# EAGLE board combined (EAGLE 9.6.2), part 1 of 2
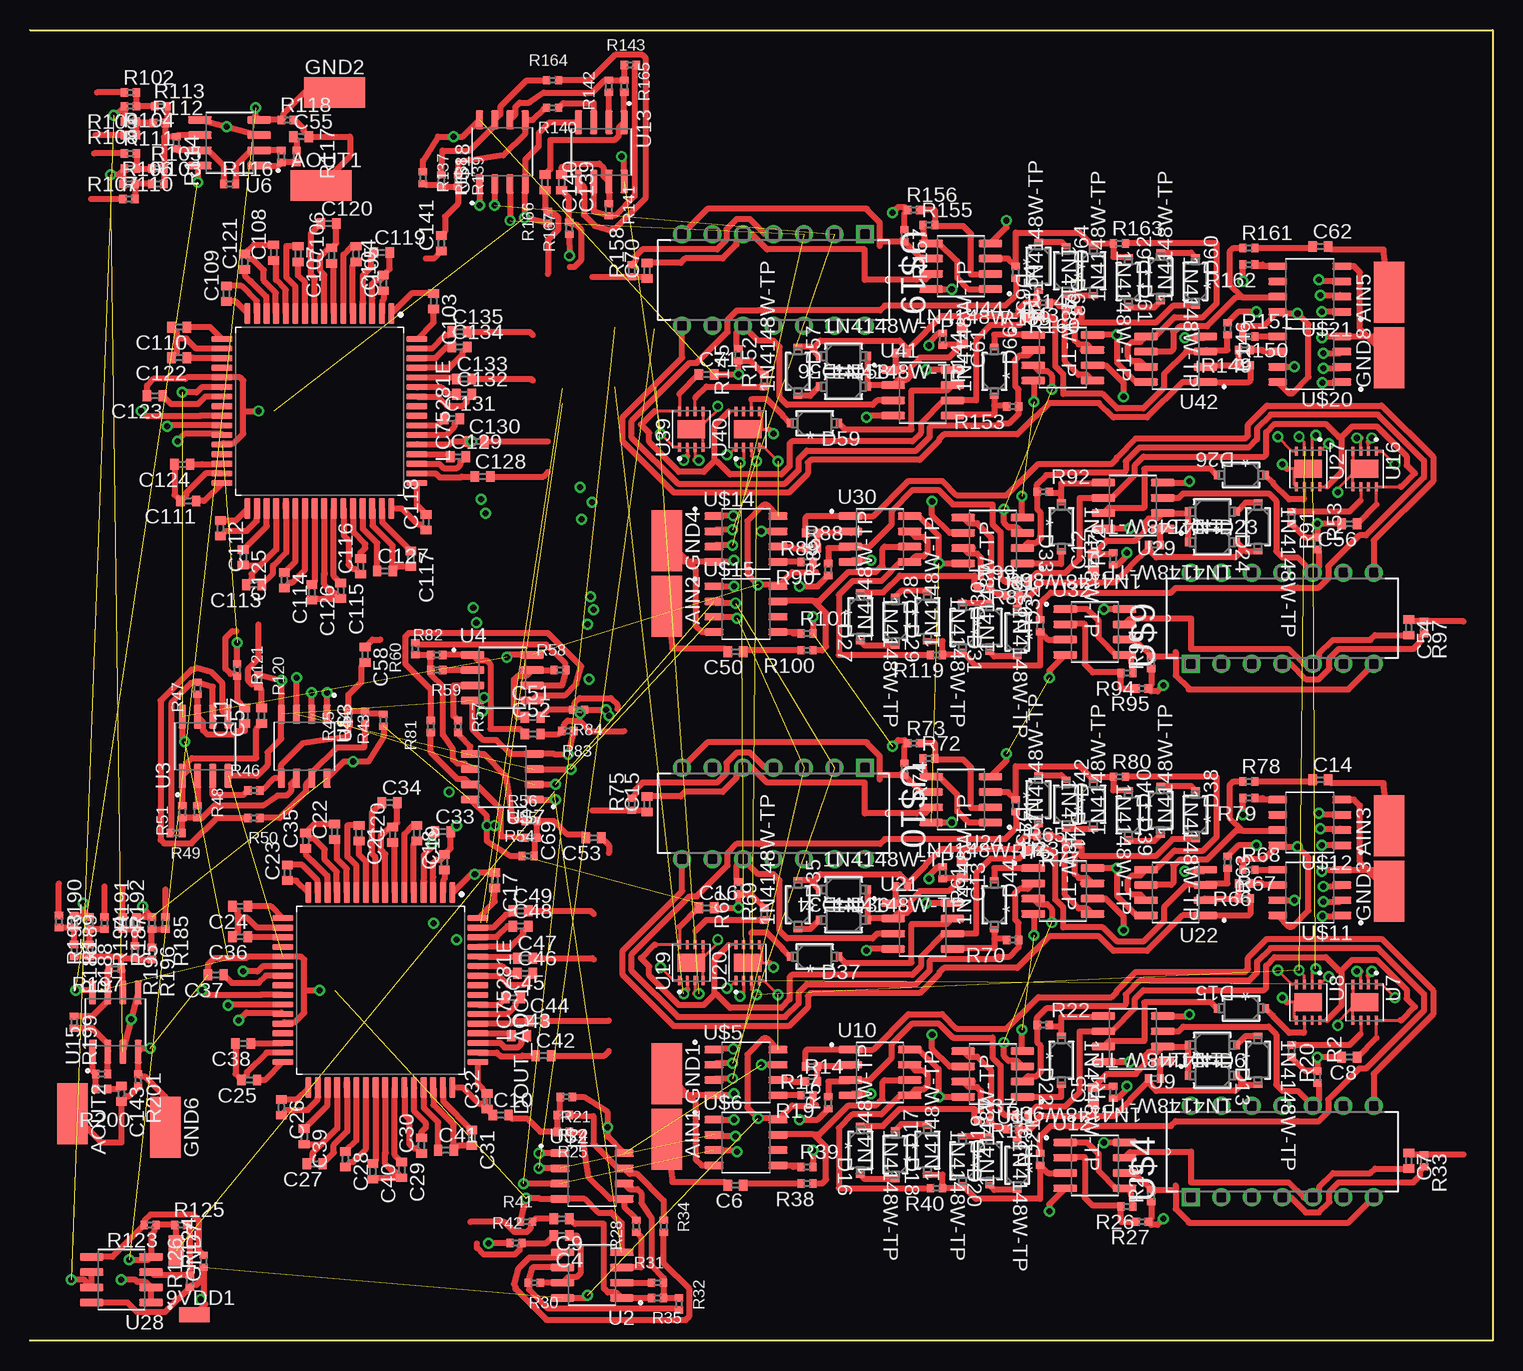
[diagram p5: board, top side]
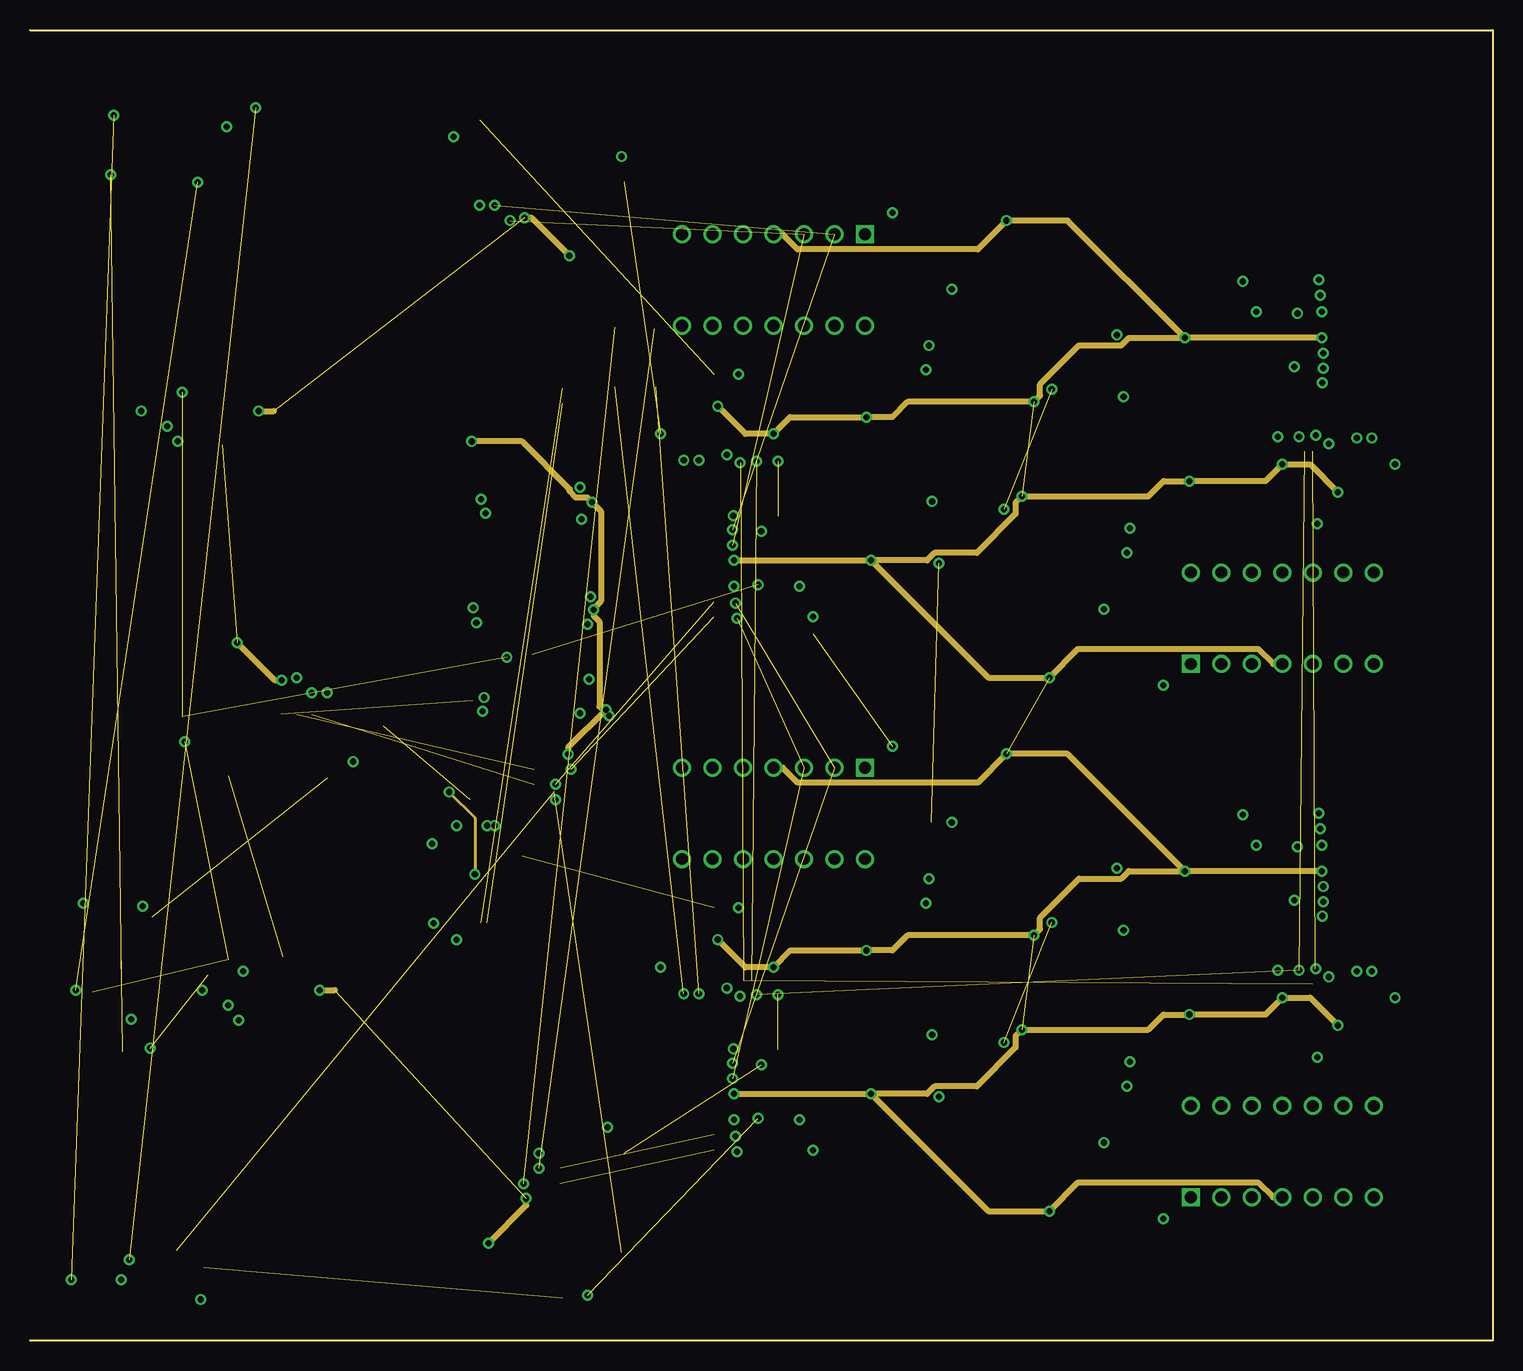
[diagram p6: board, inner layer Route2]
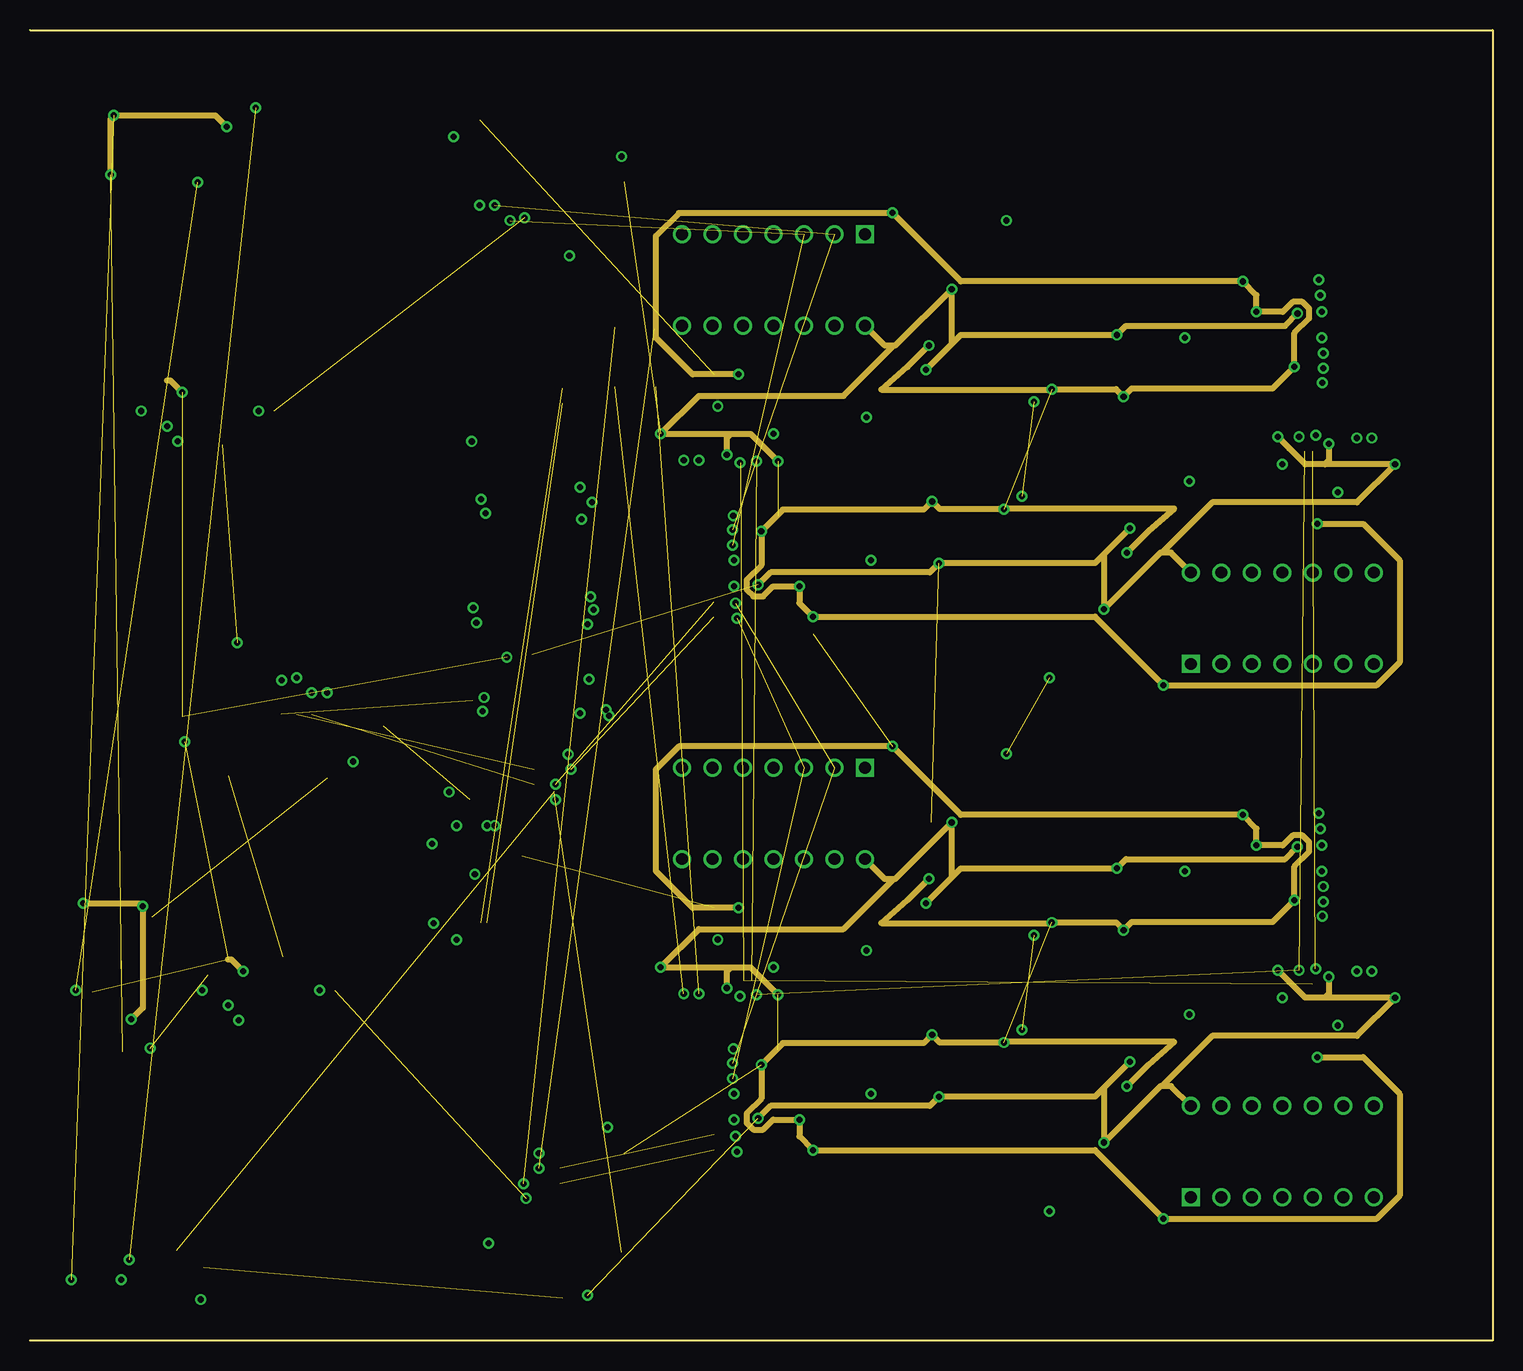
[diagram p7: board, inner layer Route15]
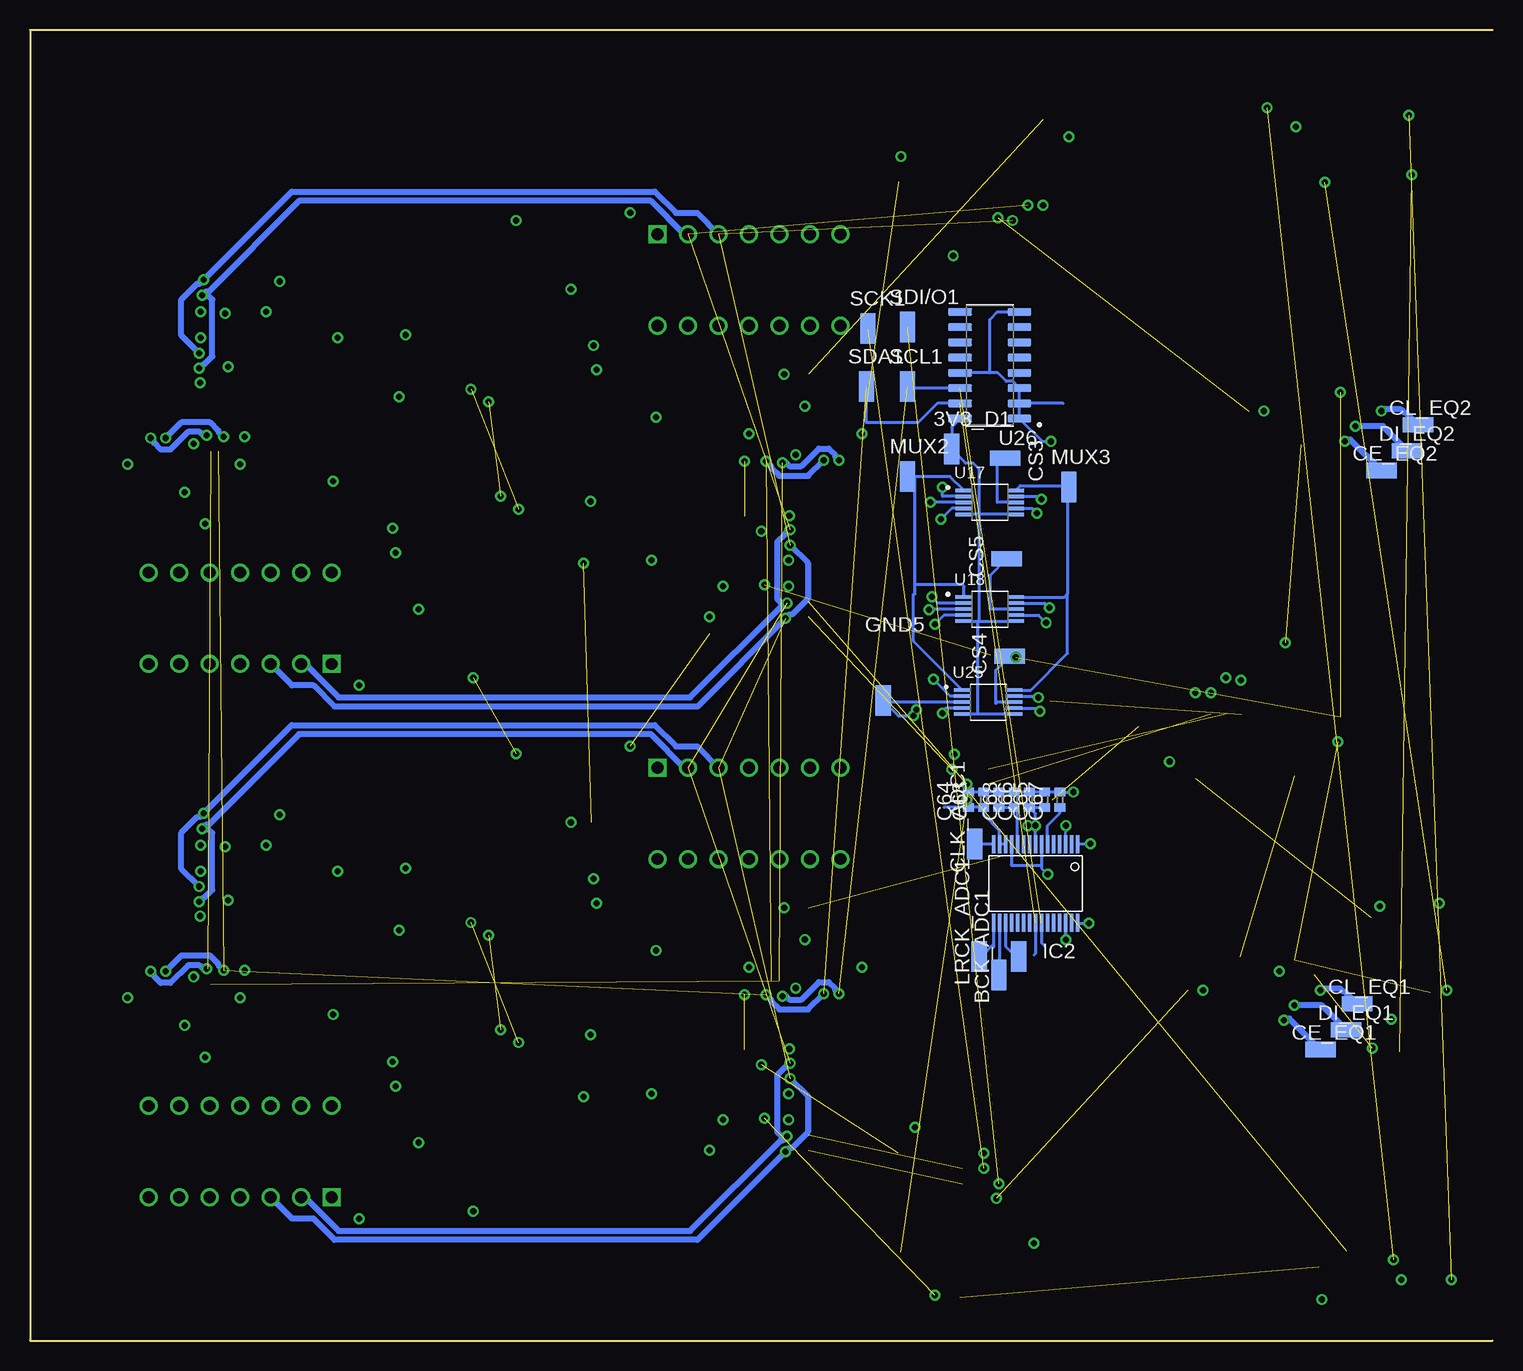
[diagram p8: board, bottom side, seen from below]

Size 121.92 x 109.22 mm. Coordinates in mm from the lower left corner, seen from the top.
Outline: 0,109.22 121.92,109.22 121.92,0 0,0
Copper layers (1+2*15+16): Top 0.035mm / dielectric 0.2mm / Route2 0.035mm / dielectric 0.15mm / Route15 0.035mm / dielectric 0.2mm / Bottom 0.035mm
Design rules "default *": minimum track width 6mil, minimum drill 0.35mm, track to track 6mil, track to pad 6mil, pad to pad 6mil, via to via 6mil, smd to smd 6mil, copper to edge 40mil, drill to drill 6mil, minimum pad ring 10mil, minimum via ring 8mil, stop-mask expansion 4mil, vias tented up to drill 0mil, thermal gap 10mil
Net classes: 4 ANALOG: width 0.508 mm, drill 0.508 mm, clearance 0.254 mm

## Footprints (pad centres in the part's own frame; a part is rotated, then mirrored left to right if it is on the bottom)
SMD1,27-2,54 = smd 1.27 x 2.54: 1 0,0
SMD2,54-5,08 = smd 2.54 x 5.08: 1 0,0
C0402 = smd 0.7 x 0.9: 1 -0.65,0; 2 0.65,0
SOD123 = smd 0.508 x 0.711: A 2.032,0; C -2.032,0
TSSOP-30 = smd 0.3 x 1.5: 1 -3.5,-3.27; 2 -3,-3.27; 3 -2.5,-3.27; 4 -2,-3.27; 5 -1.5,-3.27; 6 -1,-3.27; 7 -0.5,-3.27; 8 0,-3.27; 9 0.5,-3.27; 10 1,-3.27; 11 1.5,-3.27; 12 2,-3.27; 13 2.5,-3.27; 14 3,-3.27; 15 3.5,-3.27; 16 3.5,3.27; 17 3,3.27; 18 2.5,3.27; 19 2,3.27; 20 1.5,3.27; 21 1,3.27; 22 0.5,3.27; 23 0,3.27; 24 -0.5,3.27; 25 -1,3.27; 26 -1.5,3.27; 27 -2,3.27; 28 -2.5,3.27; 29 -3,3.27; 30 -3.5,3.27
R0402 = smd 0.6 x 0.7: 1 -0.5,0; 2 0.5,0
SOIC127P599X175-8N = smd 1.97 x 0.6: 1 -2.47,1.905; 2 -2.47,0.635; 3 -2.47,-0.635; 4 -2.47,-1.905; 5 2.47,-1.905; 6 2.47,-0.635; 7 2.47,0.635; 8 2.47,1.905
SON65P300X300X80-9N = smd 0.76 x 0.32: 1 -1.485,0.975; 2 -1.485,0.325; 3 -1.485,-0.325; 4 -1.485,-0.975; 5 1.485,-0.975; 6 1.485,-0.325; 7 1.485,0.325; 8 1.485,0.975 | smd 1.5 x 2.3: 9 0,0
SOP50P490X110-10N = smd 1.47 x 0.28: 1 -2.15,1; 2 -2.15,0.5; 3 -2.15,0; 4 -2.15,-0.5; 5 -2.15,-1; 6 2.15,-1; 7 2.15,-0.5; 8 2.15,0; 9 2.15,0.5; 10 2.15,1
SOIC127P600X175-16N = smd 1.97 x 0.6: 1 -2.475,4.445; 2 -2.475,3.175; 3 -2.475,1.905; 4 -2.475,0.635; 5 -2.475,-0.635; 6 -2.475,-1.905; 7 -2.475,-3.175; 8 -2.475,-4.445; 9 2.475,-4.445; 10 2.475,-3.175; 11 2.475,-1.905; 12 2.475,-0.635; 13 2.475,0.635; 14 2.475,1.905; 15 2.475,3.175; 16 2.475,4.445
SOIC127P599X175-8N' = smd 1.58 x 0.6: 1 -2.67,1.905; 2 -2.67,0.635; 3 -2.67,-0.635; 4 -2.67,-1.905; 5 2.67,-1.905; 6 2.67,-0.635; 7 2.67,0.635; 8 2.67,1.905
DIP254P762X432-14 = drill 0.991 square: 1 -7.62,15.24 | drill 0.991: 2 -7.62,12.7; 3 -7.62,10.16; 4 -7.62,7.62; 5 -7.62,5.08; 6 -7.62,2.54; 7 -7.62,0; 8 0,0; 9 0,2.54; 10 0,5.08; 11 0,7.62; 12 0,10.16; 13 0,12.7; 14 0,15.24
QFP80P1720X1720X270-64N = smd 1.758 x 0.522: 1 -8.127,6; 2 -8.127,5.2; 3 -8.127,4.4; 4 -8.127,3.6; 5 -8.127,2.8; 6 -8.127,2; 7 -8.127,1.2; 8 -8.127,0.4; 9 -8.127,-0.4; 10 -8.127,-1.2; 11 -8.127,-2; 12 -8.127,-2.8; 13 -8.127,-3.6; 14 -8.127,-4.4; 15 -8.127,-5.2; 16 -8.127,-6; 33 8.127,-6; 34 8.127,-5.2; 35 8.127,-4.4; 36 8.127,-3.6; 37 8.127,-2.8; 38 8.127,-2; 39 8.127,-1.2; 40 8.127,-0.4; 41 8.127,0.4; 42 8.127,1.2; 43 8.127,2; 44 8.127,2.8; 45 8.127,3.6; 46 8.127,4.4; 47 8.127,5.2; 48 8.127,6 | smd 0.522 x 1.758: 17 -6,-8.127; 18 -5.2,-8.127; 19 -4.4,-8.127; 20 -3.6,-8.127; 21 -2.8,-8.127; 22 -2,-8.127; 23 -1.2,-8.127; 24 -0.4,-8.127; 25 0.4,-8.127; 26 1.2,-8.127; 27 2,-8.127; 28 2.8,-8.127; 29 3.6,-8.127; 30 4.4,-8.127; 31 5.2,-8.127; 32 6,-8.127; 49 6,8.127; 50 5.2,8.127; 51 4.4,8.127; 52 3.6,8.127; 53 2.8,8.127; 54 2,8.127; 55 1.2,8.127; 56 0.4,8.127; 57 -0.4,8.127; 58 -1.2,8.127; 59 -2,8.127; 60 -2.8,8.127; 61 -3.6,8.127; 62 -4.4,8.127; 63 -5.2,8.127; 64 -6,8.127

## Placement (x,y rotation side)
3V3_D1  [SMD1,27-2,54]  45.09,74.3 0 bottom
9VDD1  [SMD1,27-2,54]  13.72,2.16 270 top
AIN1  [SMD2,54-5,08]  53.09,16.76 180 top
AIN2  [SMD2,54-5,08]  53.09,61.21 180 top
AIN3  [SMD2,54-5,08]  113.28,42.93 0 top
AIN5  [SMD2,54-5,08]  113.28,87.38 0 top
AOUT1  [SMD2,54-5,08]  24.26,96.27 270 top
AOUT2  [SMD2,54-5,08]  3.56,18.92 180 top
BCK_ADC1  [SMD1,27-2,54]  41.15,30.48 0 bottom
C4  0.1u  [C0402]  44.32,8.76 180 top
C5  680p  [C0402]  88.65,20.45 90 top
C6  0.1  [C0402]  58.8,12.95 180 top
C7  1.5u  [C0402]  114.94,14.99 270 top
C8  1.5u  [C0402]  109.98,23.62 180 top
C9  0.1u  [C0402]  44.32,10.16 180 top
C10  0.1u  [C0402]  39.24,18.8 0 top
C11  0.1u  [C0402]  17.91,52.07 90 top
C12  680p  [C0402]  88.65,64.9 90 top
C13  680p  [C0402]  77.72,39.24 270 top
C14  0.1  [C0402]  107.57,46.74 0 top
C15  1.5u  [C0402]  51.44,44.7 90 top
C16  1.5u  [C0402]  56.39,36.07 0 top
C17  0.047uF  [C0402]  38.73,38.35 270 top
C18  0.047uF  [C0402]  34.54,39.88 90 top
C19  0.047uF  [C0402]  32.26,42.29 270 top
C20  0.047uF  [C0402]  30.23,42.16 90 top
C21  0.047uF  [C0402]  27.43,42.29 270 top
C22  0.047uF  [C0402]  25.4,42.42 90 top
C23  0.047uF  [C0402]  21.46,38.99 90 top
C24  0.047uF  [C0402]  17.53,36.2 180 top
C25  0.047uF  [C0402]  18.29,21.72 180 top
C26  0.047uF  [C0402]  20.95,19.43 270 top
C27  0.047uF  [C0402]  23.75,14.73 180 top
C28  0.047uF  [C0402]  26.29,15.11 270 top
C29  0.047uF  [C0402]  30.99,14.22 270 top
C30  0.047uF  [C0402]  32.64,16.26 90 top
C31  0.047uF  [C0402]  36.83,16.89 270 top
C32  0.047uF  [C0402]  38.1,19.94 90 top
C33  10uF  [C0402]  34.42,42.42 0 top
C34  10uF  [C0402]  29.97,44.83 0 top
C35  10uF  [C0402]  22.99,41.66 90 top
C36  10uF  [C0402]  17.53,33.66 180 top
C37  10uF  [C0402]  15.49,30.48 180 top
C38  10uF  [C0402]  17.78,24.77 180 top
C39  10uF  [C0402]  22.86,17.02 270 top
C40  10uF  [C0402]  28.57,14.1 270 top
C41  10uF  [C0402]  34.67,15.88 0 top
C42  10uF  [C0402]  42.8,23.75 0 top
C43  10uF  [C0402]  40.77,25.4 0 top
C44  10uF  [C0402]  42.29,26.67 0 top
C45  10uF  [C0402]  40.26,28.57 0 top
C46  10uF  [C0402]  41.27,30.61 0 top
C47  10uF  [C0402]  41.27,31.88 0 top
C48  10uF  [C0402]  40.89,34.54 0 top
C49  10uF  [C0402]  40.89,35.81 0 top
C50  0.1  [C0402]  58.8,57.4 180 top
C51  0.1u  [C0402]  41.91,51.94 0 top
C52  0.1u  [C0402]  41.91,50.55 0 top
C53  0.1u  [C0402]  46.99,41.91 180 top
C54  1.5u  [C0402]  114.94,59.44 270 top
C55  0.1u  [C0402]  22.61,100.33 0 top
C56  1.5u  [C0402]  109.98,68.07 180 top
C57  0.1u  [C0402]  19.3,52.07 90 top
C58  0.1u  [C0402]  27.94,57.15 270 top
C61  680p  [C0402]  77.72,83.69 270 top
C62  0.1  [C0402]  107.57,91.19 0 top
C63  0.1μF  [C0402]  42.42,45.09 90 bottom
C64  10μF  [C0402]  43.69,45.09 90 bottom
C65  0.1μF  [C0402]  37.34,45.09 90 bottom
C66  10μF  [C0402]  38.61,45.09 90 bottom
C67  1μF  [C0402]  36.07,45.09 90 bottom
C68  0.1μF  [C0402]  39.88,45.09 90 bottom
C69  1μF  [C0402]  41.15,45.09 90 bottom
C70  1.5u  [C0402]  51.44,89.15 90 top
C71  1.5u  [C0402]  56.39,80.52 0 top
C103  0.047uF  [C0402]  33.66,86.61 270 top
C104  0.047uF  [C0402]  29.46,88.14 90 top
C105  0.047uF  [C0402]  27.18,90.55 270 top
C106  0.047uF  [C0402]  25.15,90.42 90 top
C107  0.047uF  [C0402]  22.35,90.55 270 top
C108  0.047uF  [C0402]  20.32,90.68 90 top
C109  0.047uF  [C0402]  16.38,87.25 90 top
C110  0.047uF  [C0402]  12.45,84.45 180 top
C111  0.047uF  [C0402]  13.21,69.98 180 top
C112  0.047uF  [C0402]  15.88,67.69 270 top
C113  0.047uF  [C0402]  18.67,62.99 180 top
C114  0.047uF  [C0402]  21.21,63.37 270 top
C115  0.047uF  [C0402]  25.91,62.48 270 top
C116  0.047uF  [C0402]  27.56,64.52 90 top
C117  0.047uF  [C0402]  31.75,65.15 270 top
C118  0.047uF  [C0402]  33.02,68.2 90 top
C119  10uF  [C0402]  29.34,90.68 0 top
C120  10uF  [C0402]  24.89,93.09 0 top
C121  10uF  [C0402]  17.91,89.92 90 top
C122  10uF  [C0402]  12.45,81.92 180 top
C123  10uF  [C0402]  10.41,78.74 180 top
C124  10uF  [C0402]  12.7,73.03 180 top
C125  10uF  [C0402]  17.78,65.28 270 top
C126  10uF  [C0402]  23.5,62.36 270 top
C127  10uF  [C0402]  29.59,64.14 0 top
C128  10uF  [C0402]  37.72,72.01 0 top
C129  10uF  [C0402]  35.69,73.66 0 top
C130  10uF  [C0402]  37.21,74.93 0 top
C131  10uF  [C0402]  35.18,76.83 0 top
C132  10uF  [C0402]  36.2,78.87 0 top
C133  10uF  [C0402]  36.2,80.14 0 top
C134  10uF  [C0402]  35.81,82.8 0 top
C135  10uF  [C0402]  35.81,84.07 0 top
C139  0.1u  [C0402]  44.32,96.52 270 top
C140  0.1u  [C0402]  42.93,96.52 270 top
C141  0.1u  [C0402]  34.29,91.44 90 top
C143  0.1u  [C0402]  7.62,20.57 270 top
CE_EQ1  [SMD1,27-2,54]  14.35,24.26 270 bottom
CE_EQ2  [SMD1,27-2,54]  9.27,72.52 270 bottom
CL_EQ1  [SMD1,27-2,54]  11.3,28.07 270 bottom
CL_EQ2  [SMD1,27-2,54]  6.22,76.33 270 bottom
CLK_ADC1  [SMD1,27-2,54]  43.18,41.4 0 bottom
CS3  [SMD1,27-2,54]  40.64,73.53 270 bottom
CS4  [SMD1,27-2,54]  40.26,57.02 90 bottom
CS5  [SMD1,27-2,54]  40.51,65.15 90 bottom
D6  1N4148W-TP  [SOD123]  98.55,24.64 0 top
D13  1N4148W-TP  [SOD123]  102.36,23.37 270 top
D14  1N4148W-TP  [SOD123]  98.55,22.1 180 top
D15  1N4148W-TP  [SOD123]  100.97,27.69 180 top
D16  1N4148W-TP  [SOD123]  69.22,15.88 270 top
D17  1N4148W-TP  [SOD123]  72.14,15.49 90 top
D18  1N4148W-TP  [SOD123]  74.8,15.88 270 top
D19  1N4148W-TP  [SOD123]  77.72,14.99 90 top
D20  1N4148W-TP  [SOD123]  80.01,14.99 270 top
D21  1N4148W-TP  [SOD123]  82.3,14.61 90 top
D22  1N4148W-TP  [SOD123]  85.98,23.37 270 top
D23  1N4148W-TP  [SOD123]  98.55,69.09 0 top
D24  1N4148W-TP  [SOD123]  102.36,67.82 270 top
D25  1N4148W-TP  [SOD123]  98.55,66.55 180 top
D26  1N4148W-TP  [SOD123]  100.97,72.14 180 top
D27  1N4148W-TP  [SOD123]  69.22,60.33 270 top
D28  1N4148W-TP  [SOD123]  72.14,59.94 90 top
D29  1N4148W-TP  [SOD123]  74.8,60.33 270 top
D30  1N4148W-TP  [SOD123]  77.72,59.44 90 top
D31  1N4148W-TP  [SOD123]  80.01,59.44 270 top
D32  1N4148W-TP  [SOD123]  82.3,59.05 90 top
D33  1N4148W-TP  [SOD123]  85.98,67.82 270 top
D34  1N4148W-TP  [SOD123]  67.82,35.05 180 top
D35  1N4148W-TP  [SOD123]  64.01,36.32 90 top
D36  1N4148W-TP  [SOD123]  67.82,37.59 0 top
D37  1N4148W-TP  [SOD123]  65.41,32 0 top
D38  1N4148W-TP  [SOD123]  97.16,43.81 90 top
D39  1N4148W-TP  [SOD123]  94.23,44.2 270 top
D40  1N4148W-TP  [SOD123]  91.57,43.81 90 top
D41  1N4148W-TP  [SOD123]  88.65,44.7 270 top
D42  1N4148W-TP  [SOD123]  86.36,44.7 90 top
D43  1N4148W-TP  [SOD123]  84.07,45.09 270 top
D44  1N4148W-TP  [SOD123]  80.39,36.32 90 top
D56  1N4148W-TP  [SOD123]  67.82,79.5 180 top
D57  1N4148W-TP  [SOD123]  64.01,80.77 90 top
D58  1N4148W-TP  [SOD123]  67.82,82.04 0 top
D59  1N4148W-TP  [SOD123]  65.41,76.45 0 top
D60  1N4148W-TP  [SOD123]  97.16,88.27 90 top
D61  1N4148W-TP  [SOD123]  94.23,88.65 270 top
D62  1N4148W-TP  [SOD123]  91.57,88.27 90 top
D63  1N4148W-TP  [SOD123]  88.65,89.15 270 top
D64  1N4148W-TP  [SOD123]  86.36,89.15 90 top
D65  1N4148W-TP  [SOD123]  84.07,89.53 270 top
D66  1N4148W-TP  [SOD123]  80.39,80.77 90 top
DI_EQ1  [SMD1,27-2,54]  12.19,25.91 270 bottom
DI_EQ2  [SMD1,27-2,54]  7.11,74.17 270 bottom
DOUT_ADC1  [SMD1,27-2,54]  39.5,32 0 bottom
GND1  [SMD2,54-5,08]  53.09,22.23 180 top
GND2  [SMD2,54-5,08]  25.4,104.01 270 top
GND3  [SMD2,54-5,08]  113.28,37.47 0 top
GND4  [SMD2,54-5,08]  53.09,66.67 180 top
GND5  [SMD1,27-2,54]  50.8,53.34 0 bottom
GND6  [SMD2,54-5,08]  11.3,17.78 180 top
GND7  [SMD1,27-2,54]  12.19,7.49 180 top
GND8  [SMD2,54-5,08]  113.28,81.92 0 top
IC2  PCM1865DBT  [TSSOP-30]  38.1,38.1 180 bottom
LRCK_ADC1  [SMD1,27-2,54]  42.8,32 0 bottom
MUX2  [SMD1,27-2,54]  48.77,72.01 0 bottom
MUX3  [SMD1,27-2,54]  35.31,71.12 0 bottom
R1  100k  [R0402]  90.3,20.7 90 top
R2  10k  [R0402]  107.31,21.97 270 top
R5  470k  [R0402]  66.55,19.81 90 top
R12  1k  [R0402]  93.73,21.84 0 top
R13  470k  [R0402]  82.68,18.8 180 top
R14  100k  [R0402]  65.15,21.59 0 top
R17  100k  [R0402]  65.15,22.86 180 top
R19  10k  [R0402]  64.77,20.45 180 top
R20  100k  [R0402]  105.16,24.13 270 top
R21  10k  [R0402]  44.7,20.32 180 top
R22  100k  [R0402]  84.45,26.29 0 top
R23  100k  [R0402]  84.2,15.11 90 top
R24  10k  [R0402]  44.45,18.8 180 top
R25  10k  [R0402]  44.45,17.4 180 top
R26  100k  [R0402]  91.44,11.18 180 top
R27  10k  [R0402]  92.71,9.91 180 top
R28  4k  [R0402]  50.55,9.53 90 top
R29  20k  [R0402]  93.47,12.06 90 top
R30  20k  [R0402]  42.04,4.83 180 top
R31  6k  [R0402]  52.32,4.83 0 top
R32  6k  [R0402]  54.1,3.05 270 top
R33  1M  [R0402]  116.2,14.99 270 top
R34  4k  [R0402]  52.83,9.53 270 top
R35  20k  [R0402]  52.32,3.56 180 top
R36  100k  [R0402]  81.92,17.65 0 top
R37  100k  [R0402]  79.5,18.29 0 top
R38  100k  [R0402]  64.77,13.08 180 top
R39  10k  [R0402]  64.77,14.48 0 top
R40  100k  [R0402]  75.56,12.7 180 top
R41  1.5M  [R0402]  41.4,9.91 0 top
R42  1.5M  [R0402]  40.51,8.13 0 top
R43  10k  [R0402]  29.46,51.69 90 top
R44  10k  [R0402]  27.94,51.94 90 top
R45  10k  [R0402]  26.54,51.94 90 top
R46  4k  [R0402]  18.67,45.85 0 top
R47  20k  [R0402]  13.97,54.36 90 top
R48  6k  [R0402]  13.97,44.07 270 top
R49  6k  [R0402]  12.19,42.29 180 top
R50  4k  [R0402]  18.67,43.56 180 top
R51  20k  [R0402]  12.7,44.07 90 top
R52  100k  [R0402]  90.3,65.15 90 top
R53  10k  [R0402]  107.31,66.42 270 top
R54  10k  [R0402]  41.53,40.39 0 top
R55  10k  [R0402]  41.78,41.91 0 top
R56  10k  [R0402]  41.78,43.31 0 top
R57  4k  [R0402]  35.69,51.18 270 top
R58  20k  [R0402]  44.2,55.88 0 top
R59  6k  [R0402]  33.91,55.88 180 top
R60  6k  [R0402]  32.13,57.66 90 top
R61  100k  [R0402]  76.07,38.99 270 top
R62  10k  [R0402]  59.05,37.72 90 top
R63  470k  [R0402]  99.82,39.88 270 top
R64  1k  [R0402]  72.64,37.85 180 top
R65  470k  [R0402]  83.69,40.89 0 top
R66  100k  [R0402]  101.22,38.1 180 top
R67  100k  [R0402]  101.22,36.83 0 top
R68  10k  [R0402]  101.6,39.24 0 top
R69  100k  [R0402]  61.21,35.56 90 top
R70  100k  [R0402]  81.92,33.4 180 top
R71  100k  [R0402]  82.17,44.58 270 top
R72  100k  [R0402]  74.93,48.51 0 top
R73  10k  [R0402]  73.66,49.78 0 top
R74  20k  [R0402]  72.9,47.62 270 top
R75  1M  [R0402]  50.16,44.7 90 top
R76  100k  [R0402]  84.45,42.04 180 top
R77  100k  [R0402]  86.87,41.4 180 top
R78  100k  [R0402]  101.6,46.61 0 top
R79  10k  [R0402]  101.6,45.21 180 top
R80  100k  [R0402]  90.81,46.99 0 top
R81  4k  [R0402]  33.4,51.18 90 top
R82  20k  [R0402]  33.91,57.15 0 top
R83  1.5M  [R0402]  44.83,50.8 180 top
R84  1.5M  [R0402]  45.72,52.58 180 top
R85  470k  [R0402]  66.55,64.26 90 top
R86  1k  [R0402]  93.73,66.29 0 top
R87  470k  [R0402]  82.68,63.25 180 top
R88  100k  [R0402]  65.15,66.04 0 top
R89  100k  [R0402]  65.15,67.31 180 top
R90  10k  [R0402]  64.77,64.9 180 top
R91  100k  [R0402]  105.16,68.58 270 top
R92  100k  [R0402]  84.45,70.74 0 top
R93  100k  [R0402]  84.2,59.56 90 top
R94  100k  [R0402]  91.44,55.63 180 top
R95  10k  [R0402]  92.71,54.36 180 top
R96  20k  [R0402]  93.47,56.52 90 top
R97  1M  [R0402]  116.2,59.44 270 top
R98  100k  [R0402]  81.92,62.1 0 top
R99  100k  [R0402]  79.5,62.74 0 top
R100  100k  [R0402]  64.77,57.53 180 top
R101  10k  [R0402]  64.77,58.93 0 top
R102  5k  [R0402]  8.38,104.01 0 top
R103  20k  [R0402]  10.67,96.39 0 top
R104  5k  [R0402]  8.38,100.46 0 top
R105  20k  [R0402]  10.67,97.66 0 top
R106  5k  [R0402]  8.26,96.39 0 top
R107  5k  [R0402]  8.38,97.66 180 top
R108  5k  [R0402]  8.38,101.6 180 top
R109  5k  [R0402]  8.38,102.87 180 top
R110  5k  [R0402]  8.26,95.12 0 top
R111  5k  [R0402]  8.38,98.93 0 top
R112  20k  [R0402]  10.79,101.47 0 top
R113  20k  [R0402]  10.92,102.87 0 top
R114  20k  [R0402]  12.19,99.82 270 top
R115  20k  [R0402]  20.95,98.68 270 top
R116  20k  [R0402]  16.64,96.39 0 top
R117  1k  [R0402]  22.23,98.68 90 top
R118  1.5M  [R0402]  21.46,101.73 0 top
R119  100k  [R0402]  75.56,57.15 180 top
R120  1.5M  [R0402]  19.05,54.99 270 top
R121  1.5M  [R0402]  17.27,55.88 270 top
R123  1k  [R0402]  10.03,9.65 180 top
R124  1k  [R0402]  14.48,6.6 90 top
R125  1k  [R0402]  12.57,9.65 0 top
R126  1.7k  [R0402]  13.34,4.95 90 top
R137  10k  [R0402]  32.77,96.9 270 top
R138  10k  [R0402]  34.29,96.65 270 top
R139  10k  [R0402]  35.69,96.65 270 top
R140  4k  [R0402]  43.56,102.74 180 top
R141  20k  [R0402]  48.26,94.23 270 top
R142  6k  [R0402]  48.26,104.52 90 top
R143  6k  [R0402]  50.04,106.3 0 top
R144  100k  [R0402]  76.07,83.44 270 top
R145  10k  [R0402]  59.05,82.17 90 top
R146  470k  [R0402]  99.82,84.33 270 top
R147  1k  [R0402]  72.64,82.3 180 top
R148  470k  [R0402]  83.69,85.34 0 top
R149  100k  [R0402]  101.22,82.55 180 top
R150  100k  [R0402]  101.22,81.28 0 top
R151  10k  [R0402]  101.6,83.69 0 top
R152  100k  [R0402]  61.21,80.01 90 top
R153  100k  [R0402]  81.92,77.85 180 top
R154  100k  [R0402]  82.17,89.03 270 top
R155  100k  [R0402]  74.93,92.96 0 top
R156  10k  [R0402]  73.66,94.23 0 top
R157  20k  [R0402]  72.9,92.08 270 top
R158  1M  [R0402]  50.16,89.15 90 top
R159  100k  [R0402]  84.45,86.49 180 top
R160  100k  [R0402]  86.87,85.85 180 top
R161  100k  [R0402]  101.6,91.06 0 top
R162  10k  [R0402]  101.6,89.66 180 top
R163  100k  [R0402]  90.81,91.44 0 top
R164  4k  [R0402]  43.56,105.03 0 top
R165  20k  [R0402]  49.53,104.52 270 top
R166  1.5M  [R0402]  43.18,93.6 90 top
R167  1.5M  [R0402]  44.96,92.71 90 top
R185  5k  [R0402]  11.3,34.8 270 top
R186  20k  [R0402]  3.68,32.51 270 top
R187  5k  [R0402]  7.75,34.8 270 top
R188  20k  [R0402]  4.95,32.51 270 top
R189  5k  [R0402]  3.68,34.92 270 top
R190  5k  [R0402]  4.95,34.8 90 top
R191  5k  [R0402]  8.89,34.8 90 top
R192  5k  [R0402]  10.16,34.8 90 top
R193  5k  [R0402]  2.41,34.92 270 top
R194  5k  [R0402]  6.22,34.8 270 top
R195  20k  [R0402]  8.76,32.38 270 top
R196  20k  [R0402]  10.16,32.26 270 top
R197  20k  [R0402]  7.11,30.99 180 top
R198  20k  [R0402]  5.97,22.23 180 top
R199  20k  [R0402]  3.68,26.54 270 top
R200  1k  [R0402]  5.97,20.95 0 top
R201  1.5M  [R0402]  9.02,21.72 270 top
SCK1  [SMD1,27-2,54]  52.07,84.33 0 bottom
SCL1  [SMD1,27-2,54]  48.77,79.5 0 bottom
SDA1  [SMD1,27-2,54]  52.2,79.5 0 bottom
SDI/O1  [SMD1,27-2,54]  48.77,84.45 0 bottom
U2  LM4562MAX/NOPB  [SOIC127P599X175-8N]  46.86,5.46 180 top
U3  LM4562MAX/NOPB  [SOIC127P599X175-8N]  14.61,49.53 90 top
U4  LM4562MAX/NOPB  [SOIC127P599X175-8N]  39.37,55.24 0 top
U6  LM4562MAX/NOPB  [SOIC127P599X175-8N]  16.64,99.82 180 top
U7  MAX5419LETA+  [SON65P300X300X80-9N]  111.25,28.19 270 top
U8  MAX5419LETA+  [SON65P300X300X80-9N]  106.55,28.19 270 top
U9  LM4562MAX/NOPB  [SOIC127P599X175-8N]  91.95,25.15 180 top
U10  LM4562MAX/NOPB  [SOIC127P599X175-8N]  70.87,22.35 0 top
U11  LM4562MAX/NOPB  [SOIC127P599X175-8N]  80.26,22.23 180 top
U12  LM4562MAX/NOPB  [SOIC127P599X175-8N]  88.77,14.61 0 top
U13  LM4562MAX/NOPB  [SOIC127P599X175-8N]  47.62,99.06 270 top
U15  LM4562MAX/NOPB  [SOIC127P599X175-8N]  7.11,26.54 90 top
U16  MAX5419LETA+  [SON65P300X300X80-9N]  111.25,72.64 270 top
U17  TMUX1204DGSR  [SOP50P490X110-10N]  41.91,69.85 0 bottom
U18  TMUX1204DGSR  [SOP50P490X110-10N]  41.91,60.96 0 bottom
U19  MAX5419LETA+  [SON65P300X300X80-9N]  55.12,31.5 90 top
U20  MAX5419LETA+  [SON65P300X300X80-9N]  59.82,31.5 90 top
U21  LM4562MAX/NOPB  [SOIC127P599X175-8N]  74.42,34.54 0 top
U22  LM4562MAX/NOPB  [SOIC127P599X175-8N]  95.5,37.34 180 top
U23  LM4562MAX/NOPB  [SOIC127P599X175-8N]  86.11,37.47 0 top
U24  LM4562MAX/NOPB  [SOIC127P599X175-8N]  77.6,45.09 180 top
U25  TMUX1204DGSR  [SOP50P490X110-10N]  42.04,53.21 0 bottom
U26  TCA9546ADR  [SOIC127P600X175-16N]  41.91,81.28 180 bottom
U27  MAX5419LETA+  [SON65P300X300X80-9N]  106.55,72.64 270 top
U28  LM4562MAX/NOPB  [SOIC127P599X175-8N]  7.62,5.08 180 top
U29  LM4562MAX/NOPB  [SOIC127P599X175-8N]  91.95,69.6 180 top
U30  LM4562MAX/NOPB  [SOIC127P599X175-8N]  70.87,66.8 0 top
U31  LM4562MAX/NOPB  [SOIC127P599X175-8N]  80.26,66.67 180 top
U32  LM4562MAX/NOPB  [SOIC127P599X175-8N]  88.77,59.05 0 top
U39  MAX5419LETA+  [SON65P300X300X80-9N]  55.12,75.95 90 top
U40  MAX5419LETA+  [SON65P300X300X80-9N]  59.82,75.95 90 top
U41  LM4562MAX/NOPB  [SOIC127P599X175-8N]  74.42,78.99 0 top
U42  LM4562MAX/NOPB  [SOIC127P599X175-8N]  95.5,81.79 180 top
U43  LM4562MAX/NOPB  [SOIC127P599X175-8N]  86.11,81.92 0 top
U44  LM4562MAX/NOPB  [SOIC127P599X175-8N]  77.6,89.53 180 top
U$2  MCP4131-503E/SN  [SOIC127P599X175-8N']  46.86,13.72 0 top
U$3  MCP4131-503E/SN  [SOIC127P599X175-8N']  22.86,49.53 270 top
U$4  MCP42100-I/P  [DIP254P762X432-14]  112.01,19.56 90 top
U$5  MCP4131-503E/SN  [SOIC127P599X175-8N']  59.69,22.35 0 top
U$6  MCP4131-503E/SN  [SOIC127P599X175-8N']  59.69,16.51 0 top
U$7  MCP4131-503E/SN  [SOIC127P599X175-8N']  39.37,46.99 180 top
U$9  MCP42100-I/P  [DIP254P762X432-14]  112.01,64.01 90 top
U$10  MCP42100-I/P  [DIP254P762X432-14]  54.36,40.13 270 top
U$11  MCP4131-503E/SN  [SOIC127P599X175-8N']  106.68,37.34 180 top
U$12  MCP4131-503E/SN  [SOIC127P599X175-8N']  106.68,43.18 180 top
U$13  LC75281E  [QFP80P1720X1720X270-64N]  29.21,29.21 270 top
U$14  MCP4131-503E/SN  [SOIC127P599X175-8N']  59.69,66.8 0 top
U$15  MCP4131-503E/SN  [SOIC127P599X175-8N']  59.69,60.96 0 top
U$16  LC75281E  [QFP80P1720X1720X270-64N]  24.13,77.47 270 top
U$18  MCP4131-503E/SN  [SOIC127P599X175-8N']  39.37,99.06 90 top
U$19  MCP42100-I/P  [DIP254P762X432-14]  54.36,84.58 270 top
U$20  MCP4131-503E/SN  [SOIC127P599X175-8N']  106.68,81.79 180 top
U$21  MCP4131-503E/SN  [SOIC127P599X175-8N']  106.68,87.63 180 top

## Tracks (layer width: path | path; a pad name or v marks a point on that pad's centre or on a via)
3V3A  (via drill 0.51)
  Top 0.508: U28.1 U28.2 9.63,4.91 8.94,4.91 8.77,5.08 v7.62,5.08
  Bottom 0.254: IC2.8 38.1,43.18 | 38.1,43.18 38.1,43.93 C66.1 C65.1 | 38.1,43.18 38.35,42.93 v38.73,42.93
3V3D
  Bottom 0.254: IC2.13 IC2.14 41.1,42.5 42.42,43.81 C63.1 C64.1 45.7,44.44 45.72,44.45
+3V3
  Bottom 0.254: U25.6 42.93,52.21 | 42.93,52.21 U25.5 | U18.5 42.93,59.96 | 42.93,59.96 42.8,59.96 | 42.8,59.96 U18.6 | U17.6 42.8,68.85 | 42.8,68.85 U17.5 | 42.8,68.85 42.8,59.96 | 42.93,59.96 42.93,52.21 | U26.16 45.09,76.14 3V3_D1.1 43.94,73.15 43.31,73.15 42.8,72.64 42.8,68.85
AIN
  Top 0.508: C6.2 57.9,13.21 53.55,13.21 AIN1.1
AIN0
  Top 0.508: C10.1 37.97,19.42 37.97,20.07
AIN1
  Top 0.508: C14.2 108.47,46.48 112.82,46.48 AIN3.1
AIN01
  Top 0.508: R110.1 5.08,95.12
AIN2
  Top 0.508: R104.1 5.46,100.46
AIN02
  Top 0.508: R193.1 2.41,38.1
AIN3
  Top 0.508: R102.1 5.59,104.01
AIN4
  Top 0.508: C62.2 108.47,90.93 112.82,90.93 AIN5.1
AIN11
  Top 0.508: R111.1 5.33,98.93
AIN12
  Top 0.508: C53.1 48.26,41.29 48.26,40.64
AIN31
  Top 0.508: C141.1 33.67,90.17 33.02,90.17
AIN33
  Top 0.508: C50.2 57.9,57.66 53.55,57.66 AIN2.1
AIN45
  Top 0.508: C58.1 28.56,58.42 29.21,58.42
AIN123
  Top 0.508: R194.1 6.22,37.85
AIN223
  Top 0.508: R187.1 7.75,37.72
AIN323
  Top 0.508: R185.1 11.3,37.59
AOUT
  Top 0.508: C7.1 115.08,15.49 R33.1 116.21,15.49 119.51,15.49
AOUT1
  Top 0.508: R118.2 22.08,101.73 22.81,100.99 22.81,100.77 C55.2 26.67,100.33 26.67,98.68 AOUT1.1
AOUT2
  Top 0.508: C15.1 51.28,44.2 R75.1 46.86,44.2
AOUT3
  Top 0.508: C54.1 115.08,59.94 R97.1 116.21,59.94 119.51,59.94
AOUT4
  Top 0.508: C70.1 51.28,88.65 R158.1 46.86,88.65
AOUT23
  Top 0.508: R201.2 9.02,21.1 8.28,20.37 8.06,20.37 C143.2 7.62,16.51 5.97,16.51 AOUT2.1
AOUTL
  Top 0.508: C9.2 42.16,10.16 R41.2 41.71,9.71 41.71,9.35 41.41,9.05 40.39,9.05 39.53,9.91 36.7,9.91
AOUTL1
  Top 0.508: C52.2 44.08,50.55 R83.2 44.52,50.99 44.52,51.36 44.82,51.66 45.84,51.66 46.7,50.8 49.53,50.8
AOUTL3
  Top 0.508: C140.2 42.93,94.35 R166.2 43.37,93.91 43.74,93.91 44.04,93.61 44.04,92.59 43.18,91.73 43.18,88.9
AOUTL4
  Top 0.508: C57.2 19.3,54.24 R120.2 18.86,54.68 18.49,54.68 18.19,54.98 18.19,56 19.05,56.86 19.05,59.69
AOUTR
  Top 0.508: C4.2 43.04,8.13 R42.2 40.82,7.94 40.82,7.57 40.41,7.16 37.82,7.16 37.26,7.73 37.26,8.08
AOUTR1
  Top 0.508: C51.2 43.2,52.58 R84.2 45.41,52.77 45.41,53.14 45.82,53.55 48.41,53.55 48.98,52.98 48.98,52.62
AOUTR3
  Top 0.508: C139.2 44.96,95.23 R167.2 45.15,93.02 45.52,93.02 45.93,92.61 45.93,90.02 45.36,89.45 45,89.45
AOUTR4
  Top 0.508: C11.2 17.27,53.35 R121.2 17.08,55.57 16.71,55.57 16.3,55.98 16.3,58.57 16.87,59.14 17.23,59.14
BCK_ADC
  Bottom 0.254: IC2.17 41.1,31.93 | 41.1,31.93 41.15,31.88 | 41.1,31.93 41.1,30.53 BCK_ADC1.1
CLK_ADC
  Bottom 0.254: IC2.15 43.02,41.37 | 43.02,41.37 43.05,41.4 | CLK_ADC1.1 43.15,41.37 43.02,41.37
CS  (via drill 0.51)
  Top 0.508: U$2.1 v42.42,15.62
CS0_0  (via drill 0.51)
  Bottom 0.254: U17.2 45.85,70.35 v45.85,71.12
CS0_1  (via drill 0.51)
  Bottom 0.254: U17.9 37.84,70.35 v37.59,70.1
CS0_2  (via drill 0.51)
  Bottom 0.254: U17.4 45.08,69.35 v45.97,68.45
CS0_3  (via drill 0.51)
  Bottom 0.254: U17.7 38.36,69.35 v37.97,68.96
CS0D
  Bottom 0.254: U17.8 41.27,69.85 41.27,72.9 CS3.1
CS1  (via drill 0.51)
  Top 0.508: U$5.1 57.07,24.3 v58.63,24.3 | U$7.1 v43.81,45.09
CS1_0  (via drill 0.51)
  Bottom 0.254: U25.2 45.2,53.71 v46.61,55.12
CS1_1  (via drill 0.51)
  Bottom 0.254: U25.9 37.97,53.71 v37.85,53.59
CS1_2  (via drill 0.51)
  Bottom 0.254: U25.4 45.59,52.71 45.85,52.45 v45.85,52.27
CS1_3  (via drill 0.51)
  Bottom 0.254: U25.7 39.88,52.7 37.97,52.7 v37.72,52.45
CS1D
  Bottom 0.254: U25.8 41.27,53.21 41.4,53.09 41.4,55.88 CS4.1
CS2  (via drill 0.51)
  Top 0.508: U$6.1 v58.67,18.41
CS2_0  (via drill 0.51)
  Bottom 0.254: U18.2 46.22,61.46 v46.74,61.98
CS2_1  (via drill 0.51)
  Bottom 0.254: U18.9 37.33,61.46 v36.96,61.09
CS2_2  (via drill 0.51)
  Bottom 0.254: U18.4 45.71,60.46 v46.48,59.69
CS2_3  (via drill 0.51)
  Bottom 0.254: U18.7 37.85,60.46 v37.21,59.82
CS2D
  Bottom 0.254: U18.8 41.91,60.96 41.91,63.75 CS5.1
CS3  (via drill 0.51)
  Top 0.508: U$18.1 v37.47,94.61
CS4  (via drill 0.51)
  Top 0.508: U$3.1 v24.77,53.98
CS11  (via drill 0.51)
  Top 0.508: U$11.1 109.3,35.39 v107.74,35.39
CS13  (via drill 0.51)
  Top 0.508: U$14.1 57.07,68.75 v58.63,68.75
CS14  (via drill 0.51)
  Top 0.508: U$20.1 109.3,79.83 v107.74,79.83
CS21  (via drill 0.51)
  Top 0.508: U$12.1 v107.7,41.27
CS23  (via drill 0.51)
  Top 0.508: U$15.1 v58.67,62.87
CS24  (via drill 0.51)
  Top 0.508: U$21.1 v107.7,85.72
DGND  (via drill 0.51)
  Route2 0.508: v48.26,52.07 47.47,52.86 47.47,59.92 46.99,60.4 v46.99,60.91 46.99,61.01 47.6,61.62 47.6,69.11 v46.86,69.85 46.46,70.26 45.49,70.26 44.98,70.76 44.98,70.95 41,74.93 v36.83,74.93
  Bottom 0.254: U26.2 U26.3 40,79.94 40.54,79.94 41.25,80.64 41.91,80.64 | U26.2 U26.1 37.53,74.93 v36.83,74.93 | 41.91,80.64 U26.13 | 41.91,80.64 41.91,85.09 41.27,85.72 U26.8 | 35.81,78.11 U26.2 | U25.3 50.67,53.21 GND5.1 49.53,52.07 v48.26,52.07 | U18.3 46.99,60.96 v46.99,60.91 | U17.3 v46.86,69.85
DOUT_ADC
  Bottom 0.254: IC2.18 40.6,32.85 39.75,32 DOUT_ADC1.1
EIN0
  Top 0.508: C44.2 48.26,26.67
EIN1
  Top 0.508: C47.2 46.86,31.88 46.99,31.75
EIN01
  Top 0.508: C130.2 43.18,74.93
EIN11
  Top 0.508: C133.2 41.78,80.14 41.91,80.01
EOUT0
  Top 0.508: C42.2 47.88,23.75 48.26,24.13
EOUT1
  Top 0.508: C49.2 46.74,35.81 46.99,35.56
EOUT01
  Top 0.508: C128.2 42.8,72.01 43.18,72.39
EOUT11
  Top 0.508: C135.2 41.66,84.07 41.91,83.82
EQ1_CE1  (via drill 0.51)
  Top 0.508: U$13.27 20.96,27.34 18.03,27.34 v17.4,26.7
  Bottom 0.508: v17.4,26.7 17.4,26.83 16.92,26.83 CE_EQ1.1
EQ1_CE2  (via drill 0.51)
  Top 0.508: U$16.27 15.88,75.6 12.95,75.6 v12.32,74.96
  Bottom 0.508: v12.32,74.96 12.32,75.09 11.84,75.09 CE_EQ2.1
EQ1_CL1  (via drill 0.51)
  Top 0.508: U$13.25 19.3,28.81 19.3,28.83 14.73,28.83 v14.35,29.21
  Bottom 0.508: v14.35,29.21 14.22,29.34 12.7,29.34 12.45,29.08 12.32,29.08 CL_EQ1.1
EQ1_CL2  (via drill 0.51)
  Top 0.508: U$16.25 14.22,77.07 14.22,77.09 9.65,77.09 v9.27,77.47
  Bottom 0.508: v9.27,77.47 9.14,77.6 7.62,77.6 7.37,77.34 7.24,77.34 CL_EQ2.1
EQ1_DI1  (via drill 0.51)
  Top 0.508: U$13.26 16.58,28.01 v16.51,27.94
  Bottom 0.508: v16.51,27.94 14.22,27.94 DI_EQ1.1
EQ1_DI2  (via drill 0.51)
  Top 0.508: U$16.26 11.5,76.27 v11.43,76.2
  Bottom 0.508: v11.43,76.2 9.14,76.2 DI_EQ2.1
GND  (via drill 0.51)  (9 unrouted)
  Top 0.508: U$13.28 21.22,26.54 22.07,26.54 22.86,27.33 22.86,29.21 | 22.86,29.21 22.86,31.75 22.6,32.01 U$13.21 18.16,32.01 18.03,31.88 15.37,31.88 14.84,31.35 C37.2 | 22.86,29.21 v24.13,29.21 | R41.1 v41.36,11.85 42.5,11.85 42.53,11.81 U$2.4 46.23,11.81 47.37,10.67 48.45,10.67 49.33,9.78 U2.4 | R42.1 v38.22,8.12 | R83.1 v44.87,48.86 43.74,48.86 43.7,48.9 U$7.4 40.01,48.9 38.86,50.04 37.78,50.04 36.9,50.92 U4.4 | R84.1 v48.01,52.58 | v18.8,102.74 18.8,102.04 U6.4 R118.1 21.16,101.92 21.16,102.29 22.88,104.01 GND2.1 | v8.26,6.73 9.84,6.73 U28.4 10.09,8.84 10.34,9.09 10.34,9.46 R123.1 R125.1 12.19,9.53 GND7.1 | R120.1 v20.99,55.03 20.99,53.9 20.95,53.86 U$3.4 20.95,50.16 19.81,49.02 19.81,47.94 18.93,47.06 U3.4 | R121.1 v17.27,58.17 | U$16.28 16.14,74.8 16.99,74.8 17.78,75.59 17.78,77.47 | 17.78,77.47 17.78,80.01 17.52,80.27 U$16.21 13.08,80.27 12.95,80.14 10.29,80.14 9.76,79.61 C123.2 | 17.78,77.47 v19.05,77.47 | R166.1 v41.24,93.56 41.24,94.69 41.27,94.73 U$18.4 41.27,98.42 42.42,99.57 42.42,100.65 43.3,101.53 U13.4 | R167.1 v44.96,90.42 | v10.03,24.38 9.33,24.38 U15.4 R201.1 9.21,22.02 9.58,22.02 11.3,20.3 GND6.1
  Route2 0.254: v34.92,45.72 37.08,43.56 v37.08,38.86
  Route2 0.508: v24.13,29.21 25.4,29.21 | v38.22,8.12 41.36,11.26 v41.36,11.85 | v48.01,52.58 44.87,49.44 v44.87,48.86 | v17.27,58.17 20.41,55.03 v20.99,55.03 | v19.05,77.47 20.32,77.47 | v44.96,90.42 41.82,93.56 v41.24,93.56
  Bottom 0.254: IC2.7 37.6,39.63 | 37.6,39.63 37.59,39.62 | IC2.12 40.1,39.66 40.13,39.62 37.61,39.62 37.6,39.63 | C64.2 C63.2 C69.2 C68.2 C66.2 C65.2 C67.2 36.05,45.72 v34.92,45.72 | 37.6,39.63 37.6,39.38 v37.08,38.86
H_0
  Top 0.254: 112.25,25.23 112.25,26.71 | 112.25,26.71 114.26,26.71 | U8.8 108.12,26.71 | U7.8 112.25,26.71
  Top 0.508: R13.1 83.9,19.52 86.3,19.52 86.84,20.07 86.87,20.07 87.5,20.7 87.5,25.78 U9.6 90.17,25.78 92.11,27.73 92.11,28.51 92.81,29.21 102.87,29.21 103.05,29.39 103.05,31.26 103.74,31.95 108,31.95 109.09,30.86 109.35,30.86 | C8.1 112.25,25.23 | 114.26,26.71 114.3,26.67 115.44,27.81 114.76,28.5 114.76,29.25 112.27,31.73 110.22,31.73 109.35,30.86 | 108.12,26.71 109.35,27.94 109.35,30.86
H_01
  Top 0.254: 54.12,34.45 54.12,32.98 | 54.12,32.98 52.11,32.98 | U20.8 58.25,32.98 | U19.8 54.12,32.98
  Top 0.508: R65.1 82.47,40.17 80.08,40.17 79.53,39.62 79.5,39.62 78.87,38.99 78.87,33.91 U21.6 76.2,33.91 74.26,31.96 74.26,31.18 73.56,30.48 63.5,30.48 63.32,30.3 63.32,28.43 62.63,27.74 58.37,27.74 57.28,28.82 57.02,28.82 | C16.1 54.12,34.45 | 52.11,32.98 52.07,33.02 50.93,31.88 51.61,31.19 51.61,30.44 54.1,27.95 56.15,27.95 57.02,28.82 | 58.25,32.98 57.02,31.75 57.02,28.82
H_03
  Top 0.254: 112.25,69.69 112.25,71.16 | 112.25,71.16 114.26,71.16 | U27.8 108.12,71.16 | U16.8 112.25,71.16
  Top 0.508: R87.1 83.9,63.97 86.3,63.97 86.84,64.52 86.87,64.52 87.5,65.15 87.5,70.23 U29.6 90.17,70.23 92.11,72.18 92.11,72.96 92.81,73.66 102.87,73.66 103.05,73.84 103.05,75.71 103.74,76.4 108,76.4 109.09,75.31 109.35,75.31 | C56.1 112.25,69.69 | 114.26,71.16 114.3,71.12 115.44,72.26 114.76,72.95 114.76,73.7 112.27,76.19 110.22,76.19 109.35,75.31 | 108.12,71.16 109.35,72.39 109.35,75.31
H_04
  Top 0.254: 54.12,78.91 54.12,77.43 | 54.12,77.43 52.11,77.43 | U40.8 58.25,77.43 | U39.8 54.12,77.43
  Top 0.508: R148.1 82.47,84.62 80.08,84.62 79.53,84.07 79.5,84.07 78.87,83.44 78.87,78.36 U41.6 76.2,78.36 74.26,76.41 74.26,75.63 73.56,74.93 63.5,74.93 63.32,74.75 63.32,72.88 62.63,72.19 58.37,72.19 57.28,73.28 57.02,73.28 | C71.1 54.12,78.91 | 52.11,77.43 52.07,77.47 50.93,76.33 51.61,75.64 51.61,74.89 54.1,72.41 56.15,72.41 57.02,73.28 | 58.25,77.43 57.02,76.2 57.02,73.28
L_0
  Top 0.254: U7.6 110.93,25.57
  Top 0.508: 110.93,25.57 109.99,24.63 R20.1
L_1
  Top 0.254: U8.6 106.23,25.71
  Top 0.508: 106.23,25.71 106.17,25.65 104.96,25.65 103.6,27.01 103.6,27.08 D15.C
L_01
  Top 0.254: U19.6 55.44,34.12
  Top 0.508: 55.44,34.12 56.38,35.06 R69.1
L_03
  Top 0.254: U16.6 110.93,70.02
  Top 0.508: 110.93,70.02 109.99,69.08 R91.1
L_04
  Top 0.254: U39.6 55.44,78.57
  Top 0.508: 55.44,78.57 56.38,79.51 R152.1
L_11
  Top 0.254: U20.6 60.14,33.98
  Top 0.508: 60.14,33.98 60.2,34.04 61.41,34.04 62.77,32.68 62.77,32.61 D37.C
L_13
  Top 0.254: U27.6 106.23,70.16
  Top 0.508: 106.23,70.16 106.17,70.1 104.96,70.1 103.6,71.46 103.6,71.53 D26.C
L_14
  Top 0.254: U40.6 60.14,78.43
  Top 0.508: 60.14,78.43 60.2,78.49 61.41,78.49 62.77,77.13 62.77,77.06 D59.C
LRCK_ADC
  Bottom 0.254: IC2.16 41.6,33.02 | 41.6,33.02 41.6,32.82 41.66,32.77 | 41.6,33.02 42.62,32 LRCK_ADC1.1
MUX0
  Bottom 0.254: U17.1 45.22,72.01 MUX2.1 48.15,72.01 48.15,62.99 | 48.15,62.99 44.19,62.99 44.06,62.87 U18.1 | U25.1 48.27,58.3 48.27,62.23 48.15,62.23 48.15,62.99
MUX1
  Bottom 0.254: 35.43,71.25 35.45,71.23 35.34,71.12 MUX3.1 | 35.43,71.25 39.36,71.25 U17.10 | 35.43,71.25 35.43,62.23 | 35.43,62.23 35.7,61.96 U18.10 | 35.43,62.23 35.43,57.28 38.5,54.21 U25.10
N$1
  Top 0.508: D6.A 101.35,25.4 D13.C | R12.2 94.23,23.05 U9.1
N$2
  Top 0.508: D17.A 72.64,18.03 74.68,18.03 D18.C | 78.61,21.59 U11.7 78.26,21.13 78.94,21.13 79.29,20.79 79.29,19.18 78.74,19.18 | D16.C 71.12,17.91 72.52,19.3 78.74,19.3 78.74,19.18 | R37.1 78.74,18.55 78.74,19.18
N$3
  Top 0.508: D14.A D6.C 96.39,24.51 U9.2 | U9.2 94.61,24.51 | 92.2,22.3 92.2,22.23 | U9.2 93.96,24.05 93.27,24.05 92.92,23.71 92.92,23.02 92.2,22.3 | R1.2 90.19,21.1 C5.2 89.77,22.22 92.13,22.22 92.2,22.3 | D17.C 69.6,13.46 D16.A
N$4
  Top 0.508: R38.2 59.58,13.08 C6.1 | D22.A 85.98,20.28 85.94,20.32 U11.1
N$5
  Top 0.508: D21.C 80.39,12.57 D20.A
N$6
  Top 0.508: R5.2 66.55,21.59 68.27,21.59 U10.3 69.98,21.72 71.84,23.58 71.84,24.72 73.56,26.45 75.73,26.45 76.93,25.24 80.24,25.24 80.24,23.59 80.9,22.93 80.9,19.18 81.28,18.8 R13.2 | D20.C D19.A
N$7
  Top 0.508: R14.2 R17.1 68.44,22.86 68.44,22.94 U10.2
N$8
  Top 0.508: U11.5 78.26,23.67 78.94,23.67 80.14,22.48 80.14,18.29 R37.2 80.38,17.91 80.58,17.91 80.83,17.65 R36.1
N$9
  Top 0.508: R35.2 U2.1 48.87,4.02 48.18,4.02 47.84,4.36 47.84,9.72 45.41,9.72 C9.1
N$10
  Top 0.508: R21.2 44.2,20.18 44.14,20.12 44.14,18.99 R24.2 R25.2 42.56,17.4 41.47,18.49 40.2,18.49 C10.2
N$11
  Top 0.508: R64.2 72.14,36.64 U21.1
N$13
  Top 0.508: D34.A 65.02,34.29 D35.C
N$14
  Top 0.508: U9.7 89.94,24.97 92.88,24.97 92.88,28.19 98.42,28.19 D15.A
N$15
  Top 0.508: D22.C 85.98,26.22 | 85.98,26.22 85.98,26.98 89.41,26.98 U9.5 | 85.98,26.22 84.94,26.22 R22.2
N$16
  Top 0.508: 83.42,21.59 U11.2 83.2,22.05 83.89,22.05 84.3,22.47 84.23,22.54 84.23,24.6 83.95,24.87 R22.1 83.95,26.92 84.71,27.68 85.6,27.68 85.78,27.86 91.17,27.86 91.35,28.04 91.35,28.82 92.5,29.97 101.6,29.97 102.29,30.66 102.29,31.58 103.42,32.72 112.37,32.72 116.2,28.88 116.2,27.5 111.37,22.66 110.8,22.66 108.22,20.08 108.22,19.06 107.45,18.3 105.68,18.3 105.66,18.29 95.5,18.29 95.11,17.89 85.09,17.89 84.2,17 R23.2
N$17
  Top 0.508: D43.C 85.98,47.12 D42.A
N$18
  Top 0.508: U12.5 91.31,12.63 | R26.1 91.71,12.63 91.31,12.63 | U12.1 88.14,16.51 89.07,15.58 89.07,14.19 90.62,12.63 91.31,12.63
N$19
  Top 0.508: R27.2 90.94,9.91 R26.2 90.87,11.25 88.59,11.25 87.92,11.92 87.92,15.29 86.35,15.29 U12.2
N$20
  Top 0.508: R43.2 29.32,52.19 29.26,52.25 28.13,52.25 R44.2 R45.2 26.54,53.83 27.63,54.92 27.63,56.19 C58.2
N$21
  Top 0.508: 82.32,16.66 D21.A 82.42,16.76 R36.2 83.4,17.65 83.98,18.24 83.98,18.53 84.22,18.76 88.65,18.76 | 88.65,18.76 90.42,18.76 91.71,20.05 91.69,20.07 93.23,21.6 | D13.A 101.35,21.34 D14.C 100.93,21.75 100.93,21.26 100.48,20.82 93.89,20.82 93.42,21.28 93.42,21.41 93.23,21.6 | R12.1 93.23,21.6 | C5.1 88.65,18.76
N$22
  Top 0.508: C19.1 31.91,42.94 31.21,42.24 U$13.6
N$23
  Top 0.508: C20.1 30.41,41.33 U$13.7
N$26
  Top 0.508: D18.A 76.06,13.84 R40.1 77.47,12.7 D19.C 78.87,11.81 84.2,11.81 R23.1 84.84,13.97 U12.3
N$27
  Top 0.508: U10.7 73.8,22.52 74.49,22.52 74.83,22.18 74.83,21.25 74.49,20.91 73.8,20.91 U10.5 | U10.5 72.95,20.45 | R40.2 67.44,12.7 67.44,17.7 68.58,18.85 70.97,18.85 72.57,20.45 U10.5
N$28
  Top 0.508: U$13.16 22.21,38.34 C23.1
N$29
  Top 0.508: U$13.17 20.1,36.2 C24.1
N$30
  Top 0.508: R34.2 52.83,6.44 54.96,4.31 54.96,2.04 54.66,1.74 43.05,1.74 40.48,4.32 40.48,4.48 40.34,4.73 40.69,5.99 41.62,6.92 43.94,6.92 U2.5
N$31
  Top 0.508: D36.A D34.C 69.98,35.18 U21.2 | U21.2 71.75,35.18 | 74.17,37.4 74.17,37.47 | U21.2 72.41,35.64 73.1,35.64 73.44,35.98 73.44,36.67 74.17,37.4 | R61.2 76.18,38.59 C13.2 76.6,37.47 74.24,37.47 74.17,37.4
N$33
  Top 0.508: U$13.32 19.59,21.72 C25.1
N$34
  Top 0.508: U$13.33 22.21,20.08 C26.1
N$35
  Top 0.508: C27.1 25.33,15.66 25.33,16.32 26.44,17.43 26.44,21.59 26.41,21.56 U$13.37
N$36
  Top 0.508: C28.1 27.21,16.68 U$13.38
N$37
  Top 0.508: C29.1 30.41,15.45 U$13.42
N$38
  Top 0.508: U$13.43 31.24,21.05 31.24,18.82 31.62,18.44 31.62,16.4 31.98,16.05 32.2,16.05 C30.1
N$39
  Top 0.508: C31.1 34.44,19.93 34.44,21.05 U$13.47
N$40
  Top 0.508: C32.1 37.66,19.73 37.44,19.73 36.09,21.08 U$13.48
N$41
  Top 0.508: D44.A 80.39,39.41 80.43,39.37 U23.1
N$42
  Top 0.508: U$13.3 33.61,38.64 33.59,38.67 33.59,39.79 33.88,40.09 34.23,40.09 34.54,40.4 C18.2 35.07,41.05 C33.2
N$43
  Top 0.508: C33.1 33.51,42.16 33.51,41.17 32.82,40.48 32.82,38.35 | 32.82,38.35 32.84,38.34 32.84,38.1 | U$13.4 32.81,38.34 32.82,38.35
N$44
  Top 0.508: U$13.9 28.81,40.27 28.51,40.58 28.51,44.02 C34.1
N$45
  Top 0.508: C35.1 22.99,40.5 23.5,39.99 23.5,40.03 24.78,38.75 24.78,37.37 U$13.14
N$46
  Top 0.508: C36.1 18.62,33.66 18.63,33.64 21.05,33.64 U$13.19
N$47
  Top 0.508: C37.1 16.82,29.81 19.08,29.81 19.69,30.41 U$13.23
N$48
  Top 0.508: C38.1 19.39,24.77 19.4,24.78 21.05,24.78 U$13.30
N$49
  Top 0.508: C39.1 24.81,19.62 U$13.35
N$50
  Top 0.508: C40.1 28.84,15.01 28.84,21.05 U$13.40
N$51
  Top 0.508: C41.1 34.02,18.2 32.84,19.38 32.84,21.05 U$13.45
N$52
  Top 0.508: U$13.50 38.91,24.01 39.24,23.68 40.99,23.68 41.06,23.75 C42.1
N$53
  Top 0.508: U$13.52 39.91,25.61 C43.1
N$54
  Top 0.508: U$13.53 37.37,26.44 40.07,26.44 40.3,26.67 C44.1
N$55
  Top 0.508: U$13.55 39.04,28.01 C45.1
N$56
  Top 0.508: U$13.59 37.37,31.18 39.38,31.18 39.95,30.61 C46.1
N$57
  Top 0.508: U$13.60 40.49,32.01 C47.1
N$58
  Top 0.508: U$13.62 37.37,33.64 38.9,33.64 39.8,34.54 C48.1
N$59
  Top 0.508: C49.1 39.93,35.5 39.68,35.5 38.59,34.41 U$13.63
N$60
  Top 0.508: U$13.5 31.98,37.37 31.98,41.36 C19.2
N$61
  Top 0.508: R63.2 99.82,38.1 98.1,38.1 U22.3 96.39,37.97 94.53,36.11 94.53,34.97 92.81,33.24 90.64,33.24 89.44,34.45 86.13,34.45 86.13,36.1 85.47,36.76 85.47,40.51 85.09,40.89 R65.2
N$62
  Top 0.508: U$13.10 28.01,39.92 27.43,40.5 C21.2
N$63
  Top 0.508: U$13.13 25.58,37.37 25.58,39.06 24.57,40.07 24.57,40.94 23.65,41.86 23.43,41.86 C35.2 23.75,43.07 C22.2
N$64
  Top 0.508: U$13.15 23.98,37.37 23.98,38.37 22.7,39.64 C23.2
N$65
  Top 0.508: U$13.18 18.94,34.41 18.11,35.24 17.62,35.24 17.32,35.53 | 17.32,35.53 17.32,35.75 C24.2 | 17.32,35.53 17.32,34.1 C36.2
N$66
  Top 0.508: U$13.31 19.71,24.01 18.08,22.38 18.08,22.16 C25.2 17.13,22.23 C38.2
N$67
  Top 0.508: C26.2 21.4,19.22 23.15,19.22 23.98,20.05 23.98,20.26 | 23.98,20.26 24.04,20.32 | U$13.34 23.98,21.05 23.98,20.26
N$68
  Top 0.508: U$13.36 25.61,17.68 24.29,16.36 | C27.2 23.54,15.17 23.54,15.61 24.29,16.36 | C39.2 24.27,16.37 24.29,16.36
N$69
  Top 0.508: C28.2 26.73,14.9 26.95,14.9 28.01,15.97 U$13.39
N$70
  Top 0.508: U$13.41 29.61,15.73 | 29.61,15.73 29.65,15.69 29.65,15.62 | 29.61,15.73 29.61,14.73 30.33,14.02 30.55,14.02 C29.2 28.7,13.57 C40.2
N$71
  Top 0.508: R66.2 R67.1 97.92,36.83 97.92,36.75 U22.2
N$72
  Top 0.508: C31.2 35.69,16.24 C41.2 35.32,17.97 33.64,19.65 33.64,21.05 U$13.46
N$73
  Top 0.508: C32.2 37.34,21.35 U$13.49
N$74
  Top 0.508: C43.2 40.98,24.96 40.98,24.74 40.68,24.44 39.56,24.44 39.19,24.81 U$13.51
N$75
  Top 0.508: C45.2 40.47,28.13 40.47,27.91 39.76,27.21 U$13.54
N$76
  Top 0.508: C46.2 41.48,30.16 41.48,29.95 41.19,29.65 39.83,29.65 39.07,30.41 U$13.58
N$77
  Top 0.508: C48.2 41.1,34.1 41.1,33.88 40.03,32.81 U$13.61
N$78
  Top 0.508: C18.1 34.54,38.47 34.44,38.37 34.44,37.37 U$13.2
N$80
  Top 0.508: C55.1 22.23,100.06 R117.2
N$81
  Top 0.508: U23.5 88.11,36.02 87.42,36.02 86.23,37.21 86.23,41.4 R77.2 85.99,41.78 85.79,41.78 85.54,42.04 R76.1
N$82
  Top 0.508: R110.2 R106.2 R103.1
N$83
  Top 0.508: R113.1 R109.1 R102.2
N$84
  Top 0.508: R104.2 R108.1 9.01,101.47 R112.1
N$85
  Top 0.508: R111.2 R107.1 R105.1
N$86
  Top 0.508: D23.A 101.35,69.85 D24.C
N$87
  Top 0.508: D28.A 72.64,62.48 74.68,62.48 D29.C
N$88
  Bottom 0.254: IC2.6 37.1,42.91 36.07,43.94 C67.1
N$89
  Bottom 0.254: IC2.11 39.6,44.16 C68.1 C69.1
N$90
  Top 0.508: D28.C 69.6,57.91 D27.A
N$91
  Top 0.508: R100.2 59.58,57.53 C50.1
N$92
  Top 0.508: R125.2 13.34,9.39 R126.2 10.35,5.45 U28.3
N$93
  Top 0.508: U28.5 6.87,6.99 R123.2 9.58,9.7 9.58,10.07 10.02,10.51 13.58,10.51 14.1,10 14.1,7.49 R124.2
N$94
  Top 0.508: D32.C 80.39,57.02 D31.A
N$95
  Top 0.508: D31.C D30.A
N$99
  Top 0.508: C103.1 31.8,87.26 U$16.1
N$100
  Top 0.508: C105.1 26.83,91.2 26.13,90.5 U$16.6
N$101
  Top 0.508: C106.1 25.33,89.59 U$16.7
N$102
  Top 0.508: D56.A 65.02,78.74 D57.C
N$103
  Top 0.508: D61.A 93.73,86.11 91.69,86.11 D62.C
N$104
  Top 0.508: D61.C 96.77,90.68 D60.A
N$105
  Top 0.508: R161.2 106.79,91.06 C62.1
N$106
  Top 0.508: D65.C 85.98,91.57 D64.A
N$107
  Top 0.508: D64.C D63.A
N$108
  Top 0.508: U$16.11 22.13,87.84 21.39,88.58 21.39,91.2 C107.1
N$109
  Top 0.508: U$16.12 21.33,87.56 20.5,88.39 20.5,89.55 C108.1
N$110
  Top 0.508: U$16.16 17.13,86.6 C109.1
N$111
  Top 0.508: U$16.17 15.02,84.45 C110.1
N$112
  Top 0.508: U$16.32 14.51,69.98 C111.1
N$113
  Top 0.508: U$16.33 17.13,68.34 C112.1
N$114
  Top 0.508: C113.1 20.25,63.92 20.25,64.58 21.36,65.69 21.36,69.85 21.33,69.82 U$16.37
N$115
  Top 0.508: C114.1 22.13,64.94 U$16.38
N$116
  Top 0.508: C115.1 25.33,63.71 U$16.42
N$117
  Top 0.508: U$16.43 26.16,69.31 26.16,67.08 26.54,66.7 26.54,64.66 26.9,64.31 27.12,64.31 C116.1
N$118
  Top 0.508: C117.1 29.36,68.19 29.36,69.31 U$16.47
N$119
  Top 0.508: C118.1 32.58,67.99 32.36,67.99 31.01,69.34 U$16.48
N$120
  Top 0.508: U$16.64 33.66,84.87 C103.2
N$121
  Top 0.508: U$16.3 28.53,86.9 28.51,86.93 28.51,88.05 28.8,88.35 29.15,88.35 29.46,88.66 C104.2 29.99,89.31 C119.2
N$122
  Top 0.508: C119.1 28.43,90.42 28.43,89.43 27.74,88.75 27.74,86.61 | 27.74,86.61 27.76,86.59 27.76,86.36 | U$16.4 27.73,86.6 27.74,86.61
N$124
  Top 0.508: U$16.9 23.73,88.53 23.43,88.84 23.43,92.28 C120.1
N$131
  Top 0.508: C121.1 17.91,88.76 18.41,88.25 18.41,88.29 19.7,87.01 19.7,85.63 U$16.14
N$132
  Top 0.508: C122.1 13.54,81.92 13.55,81.9 15.97,81.9 U$16.19
N$133
  Top 0.508: R86.2 94.23,67.5 U29.1
N$135
  Top 0.508: C123.1 11.74,78.07 14,78.07 14.61,78.67 U$16.23
N$136
  Top 0.508: C124.1 14.31,73.03 14.32,73.04 15.97,73.04 U$16.30
N$137
  Top 0.508: C125.1 19.73,67.88 U$16.35
N$138
  Top 0.508: C126.1 23.76,63.27 23.76,69.31 U$16.40
N$139
  Top 0.508: C127.1 28.94,66.45 27.76,67.64 27.76,69.31 U$16.45
N$140
  Top 0.508: U$16.50 33.83,72.27 34.16,71.94 35.91,71.94 35.98,72.01 C128.1
N$141
  Top 0.508: U21.7 76.43,34.72 73.49,34.72 73.49,31.5 67.94,31.5 D37.A
N$142
  Top 0.508: D39.A 93.73,41.66 91.69,41.66 D40.C
N$143
  Top 0.508: U$16.52 34.83,73.87 C129.1
N$144
  Top 0.508: R147.2 72.14,81.09 U41.1
N$145
  Top 0.508: U$16.53 32.29,74.7 34.99,74.7 35.22,74.93 C130.1
N$146
  Top 0.508: U$16.55 33.96,76.27 C131.1
N$147
  Top 0.508: U$16.59 32.29,79.44 34.3,79.44 34.87,78.87 C132.1
N$148
  Top 0.508: U$16.60 35.41,80.27 C133.1
N$149
  Top 0.508: U$16.62 32.29,81.9 33.82,81.9 34.72,82.8 C134.1
N$150
  Top 0.508: C135.1 34.85,83.76 34.6,83.76 33.51,82.67 U$16.63
N$151
  Top 0.508: D44.C 80.39,33.47 | 80.39,33.47 80.39,32.71 76.96,32.71 U21.5 | 80.39,33.47 81.43,33.47 R70.2
N$152
  Top 0.508: D39.C 96.77,46.23 D38.A
N$153
  Top 0.508: U$16.5 26.9,85.63 26.9,89.62 C105.2
N$154
  Top 0.508: U$16.8 24.53,88.81 24.19,89.15 24.19,90.33 25.04,91.18 C106.2 25.53,91.45 25.53,93.08 C120.2
N$155
  Top 0.508: U$16.10 22.93,88.18 22.35,88.76 C107.2
N$156
  Top 0.508: U$16.13 20.5,85.63 20.5,87.32 19.49,88.33 19.49,89.2 18.57,90.12 18.35,90.12 C121.2 18.67,91.33 C108.2
N$157
  Top 0.508: U$16.15 18.9,85.63 18.9,86.62 17.62,87.9 C109.2
N$158
  Top 0.508: U$16.18 13.86,82.67 13.03,83.5 12.54,83.5 12.24,83.8 | 12.24,83.8 12.24,84.01 C110.2 | 12.24,83.8 12.24,82.36 C122.2
N$159
  Top 0.508: U$16.31 14.63,72.27 13,70.64 13,70.42 C111.2 12.05,70.48 C124.2
N$160
  Top 0.508: C112.2 16.32,67.48 18.07,67.48 18.9,68.31 18.9,68.52 | 18.9,68.52 18.96,68.58 | U$16.34 18.9,69.31 18.9,68.52
N$161
  Top 0.508: 82.95,38.1 U23.2 83.17,37.64 82.48,37.64 82.07,37.22 82.14,37.15 82.14,35.09 82.42,34.82 R70.1 82.42,32.77 81.66,32.01 80.77,32.01 80.59,31.83 75.2,31.83 75.02,31.65 75.02,30.86 73.87,29.72 64.77,29.72 64.08,29.03 64.08,28.11 62.95,26.98 54,26.98 50.16,30.81 50.16,32.19 55,37.03 55.57,37.03 58.15,39.61 58.15,40.63 58.91,41.39 60.69,41.39 60.71,41.4 70.87,41.4 71.26,41.8 81.28,41.8 82.17,42.69 R71.2
N$162
  Top 0.508: R78.2 106.79,46.61 C14.1
N$163
  Top 0.508: U$16.36 20.53,65.94 19.2,64.61 | C113.2 18.46,63.43 18.46,63.87 19.2,64.61 | C125.2 19.19,64.63 19.2,64.61
N$164
  Top 0.508: C114.2 21.65,63.16 21.87,63.16 22.93,64.23 U$16.39
N$165
  Top 0.508: U$16.41 24.53,63.99 | 24.53,63.99 24.57,63.95 24.57,63.88 | 24.53,63.99 24.53,62.99 25.25,62.28 25.47,62.28 C115.2 23.62,61.83 C126.2
N$166
  Top 0.508: C116.2 27.56,65.66 27.94,66.04 27.94,66.38 26.96,67.36 26.96,69.31 U$16.44
N$167
  Top 0.508: C117.2 30.61,64.5 C127.2 30.24,66.23 28.56,67.91 28.56,69.31 U$16.46
N$168
  Top 0.508: C118.2 32.26,69.61 U$16.49
N$169
  Top 0.508: C129.2 35.9,73.22 35.9,73 35.6,72.7 34.48,72.7 34.11,73.07 U$16.51
N$170
  Top 0.508: C131.2 35.39,76.39 35.39,76.17 34.68,75.47 U$16.54
N$171
  Top 0.508: C132.2 36.4,78.42 36.4,78.21 36.1,77.91 34.75,77.91 33.99,78.67 U$16.58
N$172
  Top 0.508: C134.2 36.02,82.36 36.02,82.14 34.95,81.07 U$16.61
N$173
  Top 0.508: C104.1 29.46,86.73 29.36,86.62 29.36,85.63 U$16.2
N$175
  Top 0.508: R137.2 32.91,96.4 32.97,96.34 34.1,96.34 R138.2 R139.2 35.69,94.76 34.6,93.67 34.6,92.4 C141.2
N$181
  Top 0.508: U24.5 75.06,47.06 | R72.1 74.66,47.06 75.06,47.06 | U24.1 78.23,43.18 77.3,44.11 77.3,45.5 75.75,47.06 75.06,47.06
N$182
  Top 0.508: D42.C D41.A
N$191
  Top 0.508: R73.2 75.43,49.78 R72.2 75.5,48.44 77.78,48.44 78.45,47.77 78.45,44.4 80.02,44.4 U24.2
N$211
  Top 0.508: 87.76,38.1 U23.7 88.11,38.56 87.42,38.56 87.08,38.9 87.08,40.51 87.63,40.51 | D38.C 95.25,41.78 93.85,40.39 87.63,40.39 87.63,40.51 | R77.1 87.63,41.14 87.63,40.51
N$213
  Top 0.508: U6.1 20.69,97.92 R115.2 R117.1
N$221
  Top 0.508: U15.1 5.21,22.49 R198.2 R200.1
N$223
  Top 0.508: C143.1 7.35,20.95 R200.2
N$225
  Top 0.508: R193.2 R189.2 R186.1
N$226
  Top 0.508: R196.1 R192.1 R185.2
N$227
  Top 0.508: R187.2 R191.1 8.76,34.17 R195.1
N$228
  Top 0.508: R194.2 R190.1 R188.1
N$233
  Top 0.508: 78.61,66.04 U31.7 78.26,65.58 78.94,65.58 79.29,65.24 79.29,63.63 78.74,63.63 | D27.C 71.12,62.36 72.52,63.75 78.74,63.75 78.74,63.63 | R99.1 78.74,63 78.74,63.63
N$244
  Top 0.508: 87.76,82.55 U43.7 88.11,83.01 87.42,83.01 87.08,83.35 87.08,84.96 87.63,84.96 | D60.C 95.25,86.23 93.85,84.84 87.63,84.84 87.63,84.96 | R160.1 87.63,85.59 87.63,84.96
N$246
  Top 0.508: D62.A 90.31,90.3 R163.1 88.9,91.44 D63.C 87.5,92.33 82.17,92.33 R154.1 81.53,90.17 U44.3
N$261
  Top 0.508: D40.A 90.31,45.85 R80.1 88.9,46.99 D41.C 87.5,47.88 82.17,47.88 R71.1 81.53,45.72 U24.3
N$271
  Top 0.508: U22.7 92.57,37.16 91.88,37.16 91.54,37.51 91.54,38.44 91.88,38.78 92.57,38.78 U22.5 | U22.5 93.42,39.24 | R80.2 98.93,46.99 98.93,41.99 97.79,40.84 95.4,40.84 93.8,39.24 U22.5
N$312
  Top 0.508: R81.2 33.4,54.27 31.27,56.39 31.27,58.67 31.57,58.97 43.18,58.97 45.96,56.19 45.54,54.72 44.61,53.79 42.29,53.79 U4.5
N$331
  Top 0.508: R164.2 46.65,105.03 48.77,107.16 51.05,107.16 51.35,106.86 51.35,95.25 48.77,92.67 48.6,92.67 48.35,92.53 47.1,92.89 46.17,93.82 46.17,96.14 U13.5
N$333
  Top 0.508: D25.A D23.C 96.39,68.96 U29.2 | U29.2 94.61,68.96 | 92.2,66.75 92.2,66.67 | U29.2 93.96,68.5 93.27,68.5 92.92,68.16 92.92,67.47 92.2,66.75 | R52.2 90.19,65.55 C12.2 89.77,66.67 92.13,66.67 92.2,66.75
N$344
  Top 0.508: D58.A D56.C 69.98,79.63 U41.2 | U41.2 71.75,79.63 | 74.17,81.84 74.17,81.92 | U41.2 72.41,80.09 73.1,80.09 73.44,80.43 73.44,81.12 74.17,81.84 | R144.2 76.18,83.04 C61.2 76.6,81.92 74.24,81.92 74.17,81.84
N$411
  Top 0.508: U$13.64 38.73,36.61 C17.2
N$413
  Top 0.508: R116.1 16.14,97.91 14.81,99.23 14.21,99.23 U6.7 12.33,99.19 R114.2
N$414
  Top 0.508: R50.2 15.58,43.56 13.46,41.43 11.18,41.43 10.88,41.73 10.88,53.34 13.46,55.92 13.63,55.92 13.88,56.06 15.13,55.7 16.06,54.77 16.06,52.45 U3.5
N$421
  Top 0.508: R199.1 5.2,27.04 6.52,28.37 6.52,28.97 U15.7 6.48,30.85 R197.2
N$433
  Top 0.508: D33.A 85.98,64.73 85.94,64.77 U31.1
N$444
  Top 0.508: D66.A 80.39,83.86 80.43,83.82 U43.1
N$500
  Top 0.508: R28.1 50.93,8.64 50.93,6.1 U2.3
N$512
  Top 0.508: R57.1 35.31,52.06 35.31,54.61 U4.3
N$513
  Top 0.508: R116.2 17.14,97.91 18.46,99.23 19.06,99.23 U6.2 R115.1
N$514
  Top 0.508: R46.1 17.79,45.47 15.24,45.47 U3.3
N$521
  Top 0.508: R199.2 5.2,26.04 6.52,24.72 6.52,24.12 U15.2 R198.1
N$531
  Top 0.508: R140.1 44.44,103.12 46.99,103.12 U13.3
N$600
  Top 0.508: U2.2 R31.1
N$611
  Top 0.508: U$13.8 29.61,40.55 29.27,40.89 29.27,42.07 30.12,42.92 C20.2 30.61,43.2 30.61,44.82 C34.2
N$612
  Top 0.508: U4.2 R59.1
N$614
  Top 0.508: U3.2 R48.1
N$631
  Top 0.508: U13.2 R142.1
N$633
  Top 0.508: R85.2 66.55,66.04 68.27,66.04 U30.3 69.98,66.17 71.84,68.03 71.84,69.17 73.56,70.89 75.73,70.89 76.93,69.69 80.24,69.69 80.24,68.04 80.9,67.38 80.9,63.63 81.28,63.25 R87.2
N$644
  Top 0.508: R146.2 99.82,82.55 98.1,82.55 U42.3 96.39,82.42 94.53,80.56 94.53,79.42 92.81,77.69 90.64,77.69 89.44,78.9 86.13,78.9 86.13,80.55 85.47,81.21 85.47,84.96 85.09,85.34 R148.2
N$700
  Top 0.508: U2.6 41.9,6.1 R30.2 41.6,4.76 41.6,4.27 43.19,2.67 53.98,2.67 R32.2
N$711
  Top 0.508: C30.2 32.64,17.4 33.02,17.78 33.02,18.12 32.04,19.1 32.04,21.05 U$13.44
N$712
  Top 0.508: U4.6 44.34,54.61 R58.2 44.63,55.95 44.63,56.44 43.04,58.03 32.26,58.03 R60.2
N$714
  Top 0.508: U3.6 15.24,54.49 R47.2 13.9,54.79 13.41,54.79 11.82,53.2 11.82,42.42 R49.2